# EAGLE design mem (EAGLE 9.6.2)
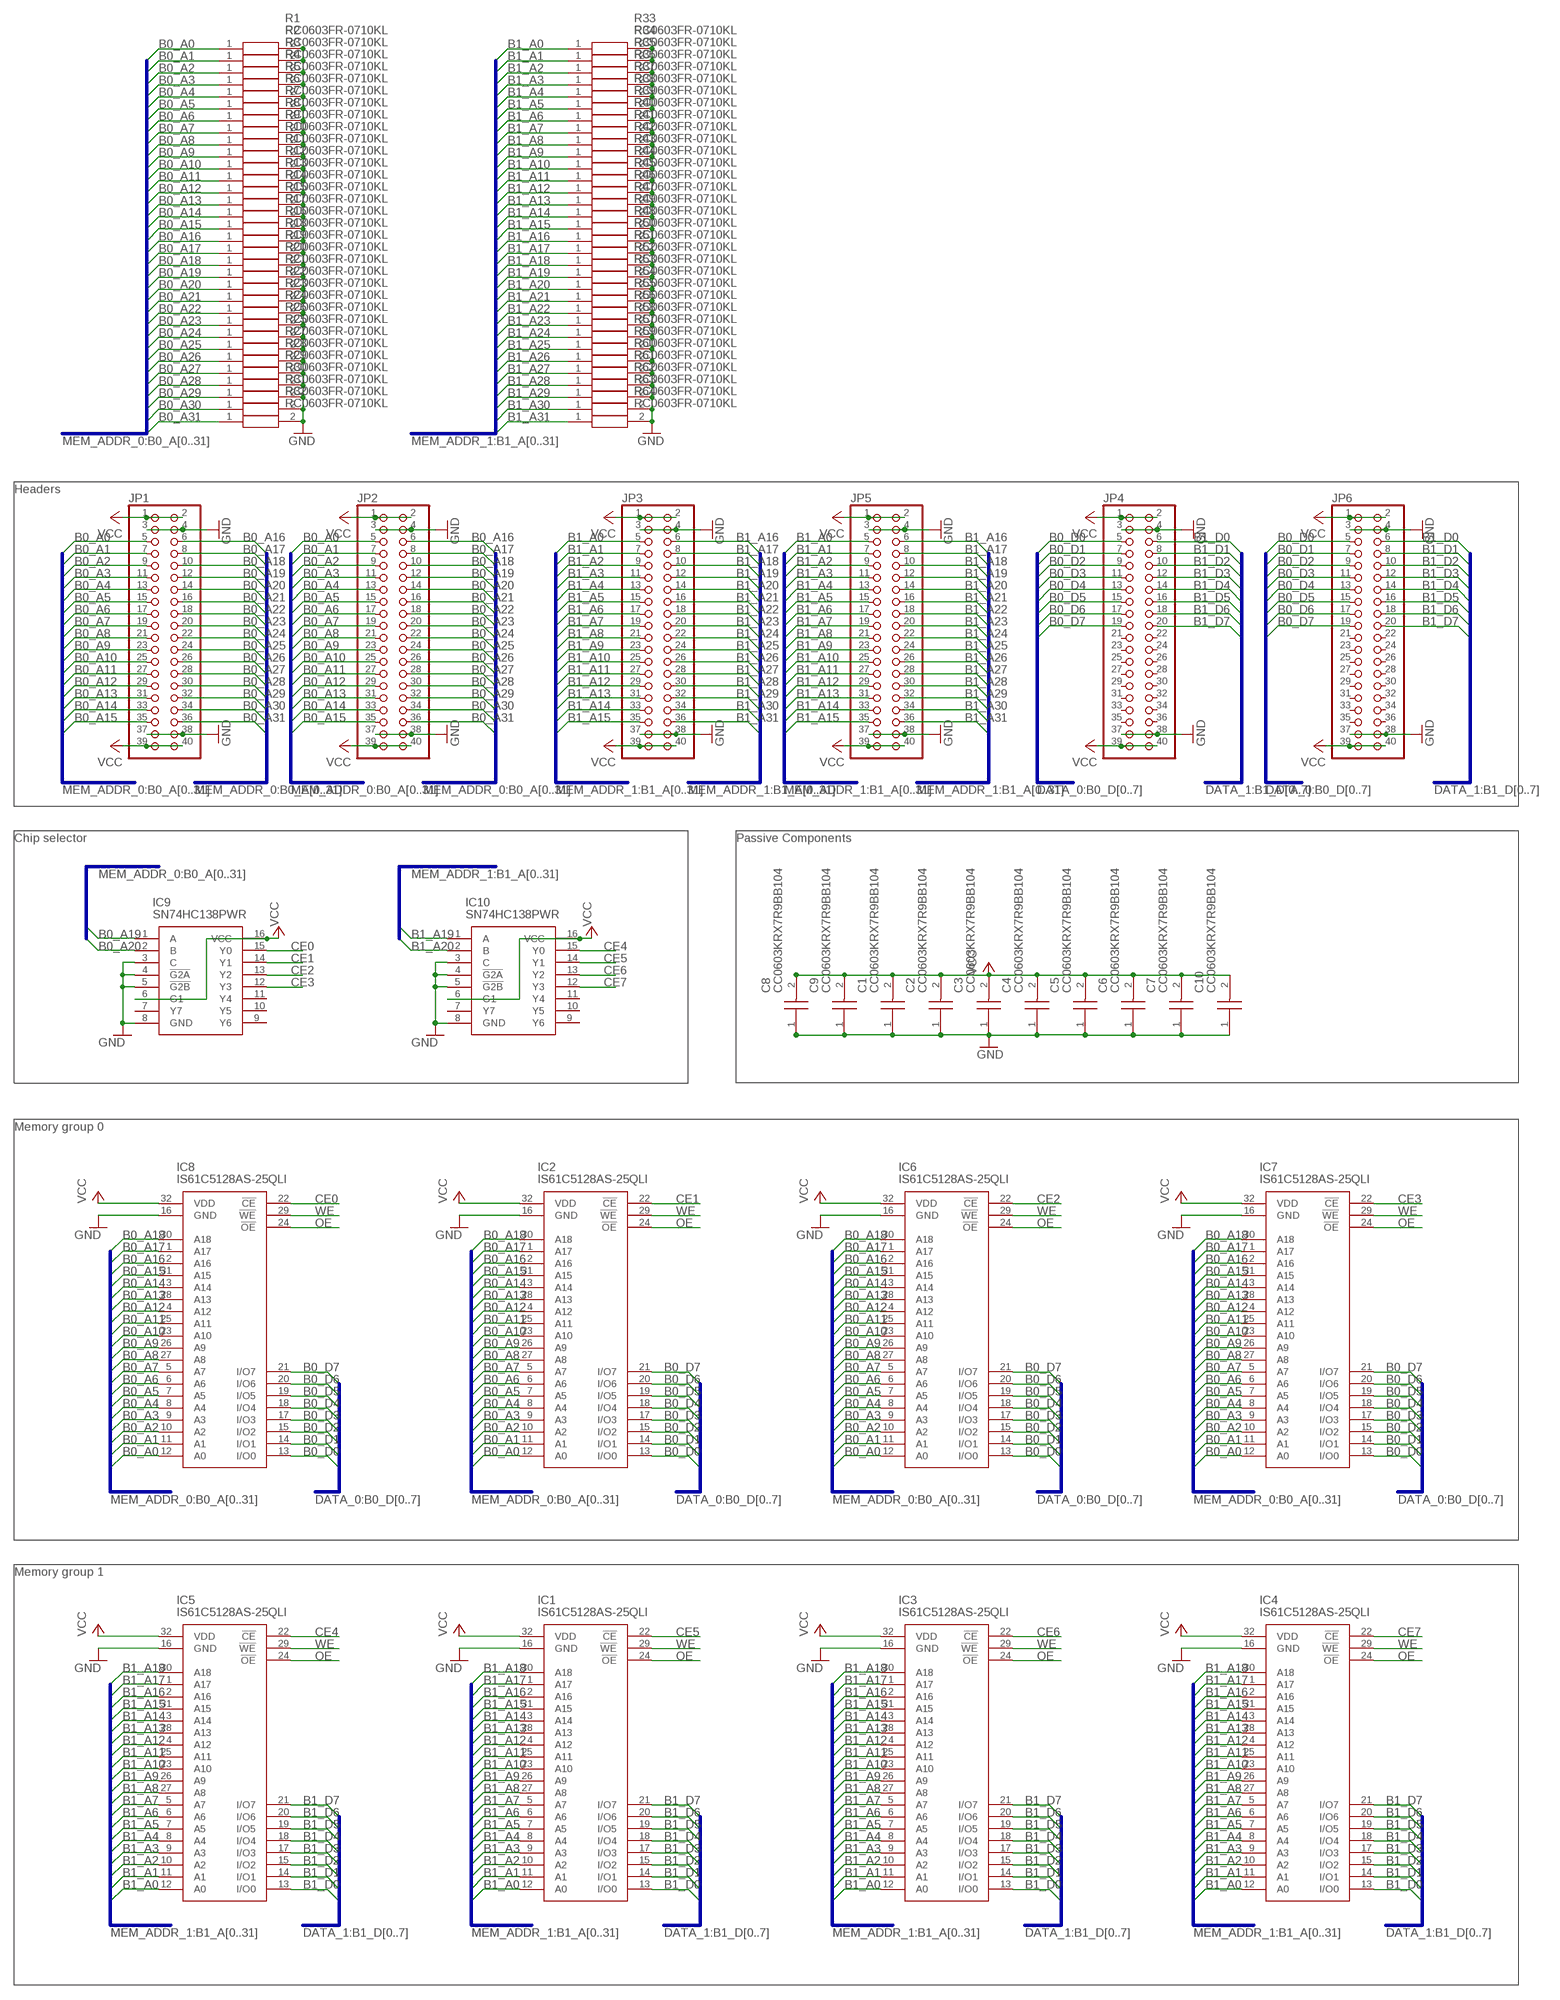
[diagram p0: schematic, sheet 1]

## Parts
C1  CC0603KRX7R9BB104  [CAPC1608X90N]
C2  CC0603KRX7R9BB104  [CAPC1608X90N]
C3  CC0603KRX7R9BB104  [CAPC1608X90N]
C4  CC0603KRX7R9BB104  [CAPC1608X90N]
C5  CC0603KRX7R9BB104  [CAPC1608X90N]
C6  CC0603KRX7R9BB104  [CAPC1608X90N]
C7  CC0603KRX7R9BB104  [CAPC1608X90N]
C8  CC0603KRX7R9BB104  [CAPC1608X90N]
C9  CC0603KRX7R9BB104  [CAPC1608X90N]
C10  CC0603KRX7R9BB104  [CAPC1608X90N]
IC1  IS61C5128AS-25QLI  [SOIC127P1412X305-32N]
IC2  IS61C5128AS-25QLI  [SOIC127P1412X305-32N]
IC3  IS61C5128AS-25QLI  [SOIC127P1412X305-32N]
IC4  IS61C5128AS-25QLI  [SOIC127P1412X305-32N]
IC5  IS61C5128AS-25QLI  [SOIC127P1412X305-32N]
IC6  IS61C5128AS-25QLI  [SOIC127P1412X305-32N]
IC7  IS61C5128AS-25QLI  [SOIC127P1412X305-32N]
IC8  IS61C5128AS-25QLI  [SOIC127P1412X305-32N]
IC9  SN74HC138PWR  [SOP65P640X120-16N]
IC10  SN74HC138PWR  [SOP65P640X120-16N]
JP1  PINHD-2X20  [2X20]
JP2  PINHD-2X20  [2X20]
JP3  PINHD-2X20  [2X20]
JP4  PINHD-2X20  [2X20]
JP5  PINHD-2X20  [2X20]
JP6  PINHD-2X20  [2X20]
R1  RC0603FR-0710KL  [RESC1608X55N]
R2  RC0603FR-0710KL  [RESC1608X55N]
R3  RC0603FR-0710KL  [RESC1608X55N]
R4  RC0603FR-0710KL  [RESC1608X55N]
R5  RC0603FR-0710KL  [RESC1608X55N]
R6  RC0603FR-0710KL  [RESC1608X55N]
R7  RC0603FR-0710KL  [RESC1608X55N]
R8  RC0603FR-0710KL  [RESC1608X55N]
R9  RC0603FR-0710KL  [RESC1608X55N]
R10  RC0603FR-0710KL  [RESC1608X55N]
R11  RC0603FR-0710KL  [RESC1608X55N]
R12  RC0603FR-0710KL  [RESC1608X55N]
R13  RC0603FR-0710KL  [RESC1608X55N]
R14  RC0603FR-0710KL  [RESC1608X55N]
R15  RC0603FR-0710KL  [RESC1608X55N]
R16  RC0603FR-0710KL  [RESC1608X55N]
R17  RC0603FR-0710KL  [RESC1608X55N]
R18  RC0603FR-0710KL  [RESC1608X55N]
R19  RC0603FR-0710KL  [RESC1608X55N]
R20  RC0603FR-0710KL  [RESC1608X55N]
R21  RC0603FR-0710KL  [RESC1608X55N]
R22  RC0603FR-0710KL  [RESC1608X55N]
R23  RC0603FR-0710KL  [RESC1608X55N]
R24  RC0603FR-0710KL  [RESC1608X55N]
R25  RC0603FR-0710KL  [RESC1608X55N]
R26  RC0603FR-0710KL  [RESC1608X55N]
R27  RC0603FR-0710KL  [RESC1608X55N]
R28  RC0603FR-0710KL  [RESC1608X55N]
R29  RC0603FR-0710KL  [RESC1608X55N]
R30  RC0603FR-0710KL  [RESC1608X55N]
R31  RC0603FR-0710KL  [RESC1608X55N]
R32  RC0603FR-0710KL  [RESC1608X55N]
R33  RC0603FR-0710KL  [RESC1608X55N]
R34  RC0603FR-0710KL  [RESC1608X55N]
R35  RC0603FR-0710KL  [RESC1608X55N]
R36  RC0603FR-0710KL  [RESC1608X55N]
R37  RC0603FR-0710KL  [RESC1608X55N]
R38  RC0603FR-0710KL  [RESC1608X55N]
R39  RC0603FR-0710KL  [RESC1608X55N]
R40  RC0603FR-0710KL  [RESC1608X55N]
R41  RC0603FR-0710KL  [RESC1608X55N]
R42  RC0603FR-0710KL  [RESC1608X55N]
R43  RC0603FR-0710KL  [RESC1608X55N]
R44  RC0603FR-0710KL  [RESC1608X55N]
R45  RC0603FR-0710KL  [RESC1608X55N]
R46  RC0603FR-0710KL  [RESC1608X55N]
R47  RC0603FR-0710KL  [RESC1608X55N]
R48  RC0603FR-0710KL  [RESC1608X55N]
R49  RC0603FR-0710KL  [RESC1608X55N]
R50  RC0603FR-0710KL  [RESC1608X55N]
R51  RC0603FR-0710KL  [RESC1608X55N]
R52  RC0603FR-0710KL  [RESC1608X55N]
R53  RC0603FR-0710KL  [RESC1608X55N]
R54  RC0603FR-0710KL  [RESC1608X55N]
R55  RC0603FR-0710KL  [RESC1608X55N]
R56  RC0603FR-0710KL  [RESC1608X55N]
R57  RC0603FR-0710KL  [RESC1608X55N]
R58  RC0603FR-0710KL  [RESC1608X55N]
R59  RC0603FR-0710KL  [RESC1608X55N]
R60  RC0603FR-0710KL  [RESC1608X55N]
R61  RC0603FR-0710KL  [RESC1608X55N]
R62  RC0603FR-0710KL  [RESC1608X55N]
R63  RC0603FR-0710KL  [RESC1608X55N]
R64  RC0603FR-0710KL  [RESC1608X55N]

## Nets
B0_A0: IC2.12(A0) IC6.12(A0) IC7.12(A0) IC8.12(A0) JP1.5 JP2.5 R1.1
B0_A1: IC2.11(A1) IC6.11(A1) IC7.11(A1) IC8.11(A1) JP1.7 JP2.7 R2.1
B0_A2: IC2.10(A2) IC6.10(A2) IC7.10(A2) IC8.10(A2) JP1.9 JP2.9 R3.1
B0_A3: IC2.9(A3) IC6.9(A3) IC7.9(A3) IC8.9(A3) JP1.11 JP2.11 R4.1
B0_A4: IC2.8(A4) IC6.8(A4) IC7.8(A4) IC8.8(A4) JP1.13 JP2.13 R5.1
B0_A5: IC2.7(A5) IC6.7(A5) IC7.7(A5) IC8.7(A5) JP1.15 JP2.15 R6.1
B0_A6: IC2.6(A6) IC6.6(A6) IC7.6(A6) IC8.6(A6) JP1.17 JP2.17 R7.1
B0_A7: IC2.5(A7) IC6.5(A7) IC7.5(A7) IC8.5(A7) JP1.19 JP2.19 R8.1
B0_A8: IC2.27(A8) IC6.27(A8) IC7.27(A8) IC8.27(A8) JP1.21 JP2.21 R9.1
B0_A9: IC2.26(A9) IC6.26(A9) IC7.26(A9) IC8.26(A9) JP1.23 JP2.23 R10.1
B0_A10: IC2.23(A10) IC6.23(A10) IC7.23(A10) IC8.23(A10) JP1.25 JP2.25 R11.1
B0_A11: IC2.25(A11) IC6.25(A11) IC7.25(A11) IC8.25(A11) JP1.27 JP2.27 R12.1
B0_A12: IC2.4(A12) IC6.4(A12) IC7.4(A12) IC8.4(A12) JP1.29 JP2.29 R13.1
B0_A13: IC2.28(A13) IC6.28(A13) IC7.28(A13) IC8.28(A13) JP1.31 JP2.31 R14.1
B0_A14: IC2.3(A14) IC6.3(A14) IC7.3(A14) IC8.3(A14) JP1.33 JP2.33 R15.1
B0_A15: IC2.31(A15) IC6.31(A15) IC7.31(A15) IC8.31(A15) JP1.35 JP2.35 R17.1
B0_A16: IC2.2(A16) IC6.2(A16) IC7.2(A16) IC8.2(A16) JP1.6 JP2.6 R16.1
B0_A17: IC2.1(A17) IC6.1(A17) IC7.1(A17) IC8.1(A17) JP1.8 JP2.8 R18.1
B0_A18: IC2.30(A18) IC6.30(A18) IC7.30(A18) IC8.30(A18) JP1.10 JP2.10 R19.1
B0_A19: IC9.1(A) JP1.12 JP2.12 R20.1
B0_A20: IC9.2(B) JP1.14 JP2.14 R21.1
B0_A21: JP1.16 JP2.16 R22.1
B0_A22: JP1.18 JP2.18 R23.1
B0_A23: JP1.20 JP2.20 R24.1
B0_A24: JP1.22 JP2.22 R26.1
B0_A25: JP1.24 JP2.24 R25.1
B0_A26: JP1.26 JP2.26 R27.1
B0_A27: JP1.28 JP2.28 R28.1
B0_A28: JP1.30 JP2.30 R29.1
B0_A29: JP1.32 JP2.32 R30.1
B0_A30: JP1.34 JP2.34 R31.1
B0_A31: JP1.36 JP2.36 R32.1
B0_D0: IC2.13(I/O0) IC6.13(I/O0) IC7.13(I/O0) IC8.13(I/O0) JP4.5 JP6.5
B0_D1: IC2.14(I/O1) IC6.14(I/O1) IC7.14(I/O1) IC8.14(I/O1) JP4.7 JP6.7
B0_D2: IC2.15(I/O2) IC6.15(I/O2) IC7.15(I/O2) IC8.15(I/O2) JP4.9 JP6.9
B0_D3: IC2.17(I/O3) IC6.17(I/O3) IC7.17(I/O3) IC8.17(I/O3) JP4.11 JP6.11
B0_D4: IC2.18(I/O4) IC6.18(I/O4) IC7.18(I/O4) IC8.18(I/O4) JP4.13 JP6.13
B0_D5: IC2.19(I/O5) IC6.19(I/O5) IC7.19(I/O5) IC8.19(I/O5) JP4.15 JP6.15
B0_D6: IC2.20(I/O6) IC6.20(I/O6) IC7.20(I/O6) IC8.20(I/O6) JP4.17 JP6.17
B0_D7: IC2.21(I/O7) IC6.21(I/O7) IC7.21(I/O7) IC8.21(I/O7) JP4.19 JP6.19
B1_A0: IC1.12(A0) IC3.12(A0) IC4.12(A0) IC5.12(A0) JP3.5 JP5.5 R33.1
B1_A1: IC1.11(A1) IC3.11(A1) IC4.11(A1) IC5.11(A1) JP3.7 JP5.7 R34.1
B1_A2: IC1.10(A2) IC3.10(A2) IC4.10(A2) IC5.10(A2) JP3.9 JP5.9 R35.1
B1_A3: IC1.9(A3) IC3.9(A3) IC4.9(A3) IC5.9(A3) JP3.11 JP5.11 R36.1
B1_A4: IC1.8(A4) IC3.8(A4) IC4.8(A4) IC5.8(A4) JP3.13 JP5.13 R37.1
B1_A5: IC1.7(A5) IC3.7(A5) IC4.7(A5) IC5.7(A5) JP3.15 JP5.15 R38.1
B1_A6: IC1.6(A6) IC3.6(A6) IC4.6(A6) IC5.6(A6) JP3.17 JP5.17 R39.1
B1_A7: IC1.5(A7) IC3.5(A7) IC4.5(A7) IC5.5(A7) JP3.19 JP5.19 R40.1
B1_A8: IC1.27(A8) IC3.27(A8) IC4.27(A8) IC5.27(A8) JP3.21 JP5.21 R41.1
B1_A9: IC1.26(A9) IC3.26(A9) IC4.26(A9) IC5.26(A9) JP3.23 JP5.23 R42.1
B1_A10: IC1.23(A10) IC3.23(A10) IC4.23(A10) IC5.23(A10) JP3.25 JP5.25 R43.1
B1_A11: IC1.25(A11) IC3.25(A11) IC4.25(A11) IC5.25(A11) JP3.27 JP5.27 R44.1
B1_A12: IC1.4(A12) IC3.4(A12) IC4.4(A12) IC5.4(A12) JP3.29 JP5.29 R45.1
B1_A13: IC1.28(A13) IC3.28(A13) IC4.28(A13) IC5.28(A13) JP3.31 JP5.31 R46.1
B1_A14: IC1.3(A14) IC3.3(A14) IC4.3(A14) IC5.3(A14) JP3.33 JP5.33 R47.1
B1_A15: IC1.31(A15) IC3.31(A15) IC4.31(A15) IC5.31(A15) JP3.35 JP5.35 R49.1
B1_A16: IC1.2(A16) IC3.2(A16) IC4.2(A16) IC5.2(A16) JP3.6 JP5.6 R48.1
B1_A17: IC1.1(A17) IC3.1(A17) IC4.1(A17) IC5.1(A17) JP3.8 JP5.8 R50.1
B1_A18: IC1.30(A18) IC3.30(A18) IC4.30(A18) IC5.30(A18) JP3.10 JP5.10 R51.1
B1_A19: IC10.1(A) JP3.12 JP5.12 R52.1
B1_A20: IC10.2(B) JP3.14 JP5.14 R53.1
B1_A21: JP3.16 JP5.16 R54.1
B1_A22: JP3.18 JP5.18 R55.1
B1_A23: JP3.20 JP5.20 R56.1
B1_A24: JP3.22 JP5.22 R58.1
B1_A25: JP3.24 JP5.24 R57.1
B1_A26: JP3.26 JP5.26 R59.1
B1_A27: JP3.28 JP5.28 R60.1
B1_A28: JP3.30 JP5.30 R61.1
B1_A29: JP3.32 JP5.32 R62.1
B1_A30: JP3.34 JP5.34 R63.1
B1_A31: JP3.36 JP5.36 R64.1
B1_D0: IC1.13(I/O0) IC3.13(I/O0) IC4.13(I/O0) IC5.13(I/O0) JP4.6 JP6.6
B1_D1: IC1.14(I/O1) IC3.14(I/O1) IC4.14(I/O1) IC5.14(I/O1) JP4.8 JP6.8
B1_D2: IC1.15(I/O2) IC3.15(I/O2) IC4.15(I/O2) IC5.15(I/O2) JP4.10 JP6.10
B1_D3: IC1.17(I/O3) IC3.17(I/O3) IC4.17(I/O3) IC5.17(I/O3) JP4.12 JP6.12
B1_D4: IC1.18(I/O4) IC3.18(I/O4) IC4.18(I/O4) IC5.18(I/O4) JP4.14 JP6.14
B1_D5: IC1.19(I/O5) IC3.19(I/O5) IC4.19(I/O5) IC5.19(I/O5) JP4.16 JP6.16
B1_D6: IC1.20(I/O6) IC3.20(I/O6) IC4.20(I/O6) IC5.20(I/O6) JP4.18 JP6.18
B1_D7: IC1.21(I/O7) IC3.21(I/O7) IC4.21(I/O7) IC5.21(I/O7) JP4.20 JP6.20
CE0: IC8.22(!CE) IC9.15(Y0)
CE1: IC2.22(!CE) IC9.14(Y1)
CE2: IC6.22(!CE) IC9.13(Y2)
CE3: IC7.22(!CE) IC9.12(Y3)
CE4: IC5.22(!CE) IC10.15(Y0)
CE5: IC1.22(!CE) IC10.14(Y1)
CE6: IC3.22(!CE) IC10.13(Y2)
CE7: IC4.22(!CE) IC10.12(Y3)
GND [power]: C1.1 C2.1 C3.1 C4.1 C5.1 C6.1 C7.1 C8.1 C9.1 C10.1 IC1.16(GND) IC2.16(GND) IC3.16(GND) IC4.16(GND) IC5.16(GND) IC6.16(GND) IC7.16(GND) IC8.16(GND) IC9.3(C) IC9.4(!G2A) IC9.5(!G2B) IC9.8(GND) IC10.3(C) IC10.4(!G2A) IC10.5(!G2B) IC10.8(GND) JP1.3 JP1.4 JP1.37 JP1.38 JP2.3 JP2.4 JP2.37 JP2.38 JP3.3 JP3.4 JP3.37 JP3.38 JP4.3 JP4.4 JP4.37 JP4.38 JP5.3 JP5.4 JP5.37 JP5.38 JP6.3 JP6.4 JP6.37 JP6.38 R1.2 R2.2 R3.2 R4.2 R5.2 R6.2 R7.2 R8.2 R9.2 R10.2 R11.2 R12.2 R13.2 R14.2 R15.2 R16.2 R17.2 R18.2 R19.2 R20.2 R21.2 R22.2 R23.2 R24.2 R25.2 R26.2 R27.2 R28.2 R29.2 R30.2 R31.2 R32.2 R33.2 R34.2 R35.2 R36.2 R37.2 R38.2 R39.2 R40.2 R41.2 R42.2 R43.2 R44.2 R45.2 R46.2 R47.2 R48.2 R49.2 R50.2 R51.2 R52.2 R53.2 R54.2 R55.2 R56.2 R57.2 R58.2 R59.2 R60.2 R61.2 R62.2 R63.2 R64.2
OE: IC1.24(!OE) IC2.24(!OE) IC3.24(!OE) IC4.24(!OE) IC5.24(!OE) IC6.24(!OE) IC7.24(!OE) IC8.24(!OE)
VCC [power]: C1.2 C2.2 C3.2 C4.2 C5.2 C6.2 C7.2 C8.2 C9.2 C10.2 IC1.32(VDD) IC2.32(VDD) IC3.32(VDD) IC4.32(VDD) IC5.32(VDD) IC6.32(VDD) IC7.32(VDD) IC8.32(VDD) IC9.6(G1) IC9.16(VCC) IC10.6(G1) IC10.16(VCC) JP1.1 JP1.2 JP1.39 JP1.40 JP2.1 JP2.2 JP2.39 JP2.40 JP3.1 JP3.2 JP3.39 JP3.40 JP4.1 JP4.2 JP4.39 JP4.40 JP5.1 JP5.2 JP5.39 JP5.40 JP6.1 JP6.2 JP6.39 JP6.40
WE: IC1.29(!WE) IC2.29(!WE) IC3.29(!WE) IC4.29(!WE) IC5.29(!WE) IC6.29(!WE) IC7.29(!WE) IC8.29(!WE)
Unconnected: IC9.7(Y7) IC9.9(Y6) IC9.10(Y5) IC9.11(Y4) IC10.7(Y7) IC10.9(Y6) IC10.10(Y5) IC10.11(Y4) JP4.21 JP4.22 JP4.23 JP4.24 JP4.25 JP4.26 JP4.27 JP4.28 JP4.29 JP4.30 JP4.31 JP4.32 JP4.33 JP4.34 JP4.35 JP4.36 JP6.21 JP6.22 JP6.23 JP6.24 JP6.25 JP6.26 JP6.27 JP6.28 JP6.29 JP6.30 JP6.31 JP6.32 JP6.33 JP6.34 JP6.35 JP6.36

## Buses
MEM_ADDR_0:B0_A[0..31]
MEM_ADDR_1:B1_A[0..31]
DATA_0:B0_D[0..7]
DATA_1:B1_D[0..7]
B$1

## Notes on the sheet
- Headers
- Chip selector | Passive Components
- Memory group 0
- Memory group 1

## Library data of the parts
C1-C10 = CC0603KRX7R9BB104:CC0603KRX7R9BB104: CAPACITOR, 0603 100nF +/-10% 50V Source: Datasheet <http://componentsearchengine.com/Datasheets/3/CC0603KRX7R9BB104.pdf>; ARROW_PART_NUMBER: CC0603KRX7R9BB104; ARROW_PRICE-STOCK: https://www.arrow.com/en/products/cc0603krx7r9bb104/yageo?region=nac; DESCRIPTION: CAPACITOR, 0603 100nF +/-10% 50V; HEIGHT: 0.9mm; MANUFACTURER_NAME: YAGEO (PHYCOMP); MANUFACTURER_PART_NUMBER: CC0603KRX7R9BB104; MOUSER_PART_NUMBER: 603-CC603KRX7R9BB104; MOUSER_PRICE-STOCK: https://www.mouser.co.uk/ProductDetail/YAGEO/CC0603KRX7R9BB104?qs=vTakOoo5QyLvVCYM2ge8LQ%3D%3D
IC1-IC8 = IS61C5128AS-25QLI:IS61C5128AS-25QLI: SRAM 4Mb,High-Speed,Low Power,Async,512K x 8,25ns,5v,32 Pin SOP (450 mil), RoHS Source: Datasheet <http://www.issi.com/WW/pdf/61-64C5128AL.pdf>; ARROW_PART_NUMBER: IS61C5128AS-25QLI; ARROW_PRICE-STOCK: https://www.arrow.com/en/products/is61c5128as-25qli/integrated-silicon-solution-inc; DESCRIPTION: SRAM 4Mb,High-Speed,Low Power,Async,512K x 8,25ns,5v,32 Pin SOP (450 mil), RoHS; HEIGHT: 3.05mm; MANUFACTURER_NAME: Integrated Silicon Solution Inc.; MANUFACTURER_PART_NUMBER: IS61C5128AS-25QLI; MOUSER_PART_NUMBER: 870-61C5128AS-25QLI; MOUSER_PRICE-STOCK: https://www.mouser.co.uk/ProductDetail/ISSI/IS61C5128AS-25QLI/?qs=v9o34zvNDAYPCnMwiEH0%252BA%3D%3D
IC9 IC10 = SN74HC138PWR:SN74HC138PWR: 3-Line To 8-Line Decoders/Demultiplexers Source: Datasheet <http://www.ti.com/lit/gpn/sn74hc138>; ARROW_PART_NUMBER: SN74HC138PWR; ARROW_PRICE-STOCK: https://www.arrow.com/en/products/sn74hc138pwr/texas-instruments; DESCRIPTION: 3-Line To 8-Line Decoders/Demultiplexers; HEIGHT: 1.2mm; MANUFACTURER_NAME: Texas Instruments; MANUFACTURER_PART_NUMBER: SN74HC138PWR; MOUSER_PART_NUMBER: 595-SN74HC138PWR; MOUSER_PRICE-STOCK: https://www.mouser.co.uk/ProductDetail/Texas-Instruments/SN74HC138PWR?qs=WzgTT80quPG%2F%252Bg2Du7xoUA%3D%3D
JP1-JP6 = pinhead:PINHD-2X20: PIN HEADER
R1-R64 = RC0603FR-0710KL:RC0603FR-0710KL: Yageo RC Series Thick Film Surface Mount Resistor 0603 Case 10k Source: Datasheet <https://datasheet.datasheetarchive.com/originals/distributors/Datasheets_SAMA/902f9e387b938f871d31120f5fc1d65e.pdf>; ARROW_PART_NUMBER: RC0603FR-0710KL; ARROW_PRICE-STOCK: https://www.arrow.com/en/products/rc0603fr-0710kl/yageo?region=nac; DESCRIPTION: Yageo RC Series Thick Film Surface Mount Resistor 0603 Case 10k; HEIGHT: 0.55mm; MANUFACTURER_NAME: YAGEO (PHYCOMP); MANUFACTURER_PART_NUMBER: RC0603FR-0710KL; MOUSER_PART_NUMBER: 603-RC0603FR-0710KL; MOUSER_PRICE-STOCK: https://www.mouser.co.uk/ProductDetail/YAGEO/RC0603FR-0710KL?qs=grNVn54RoB%252B3GtjbJj3wJQ%3D%3D

## Board
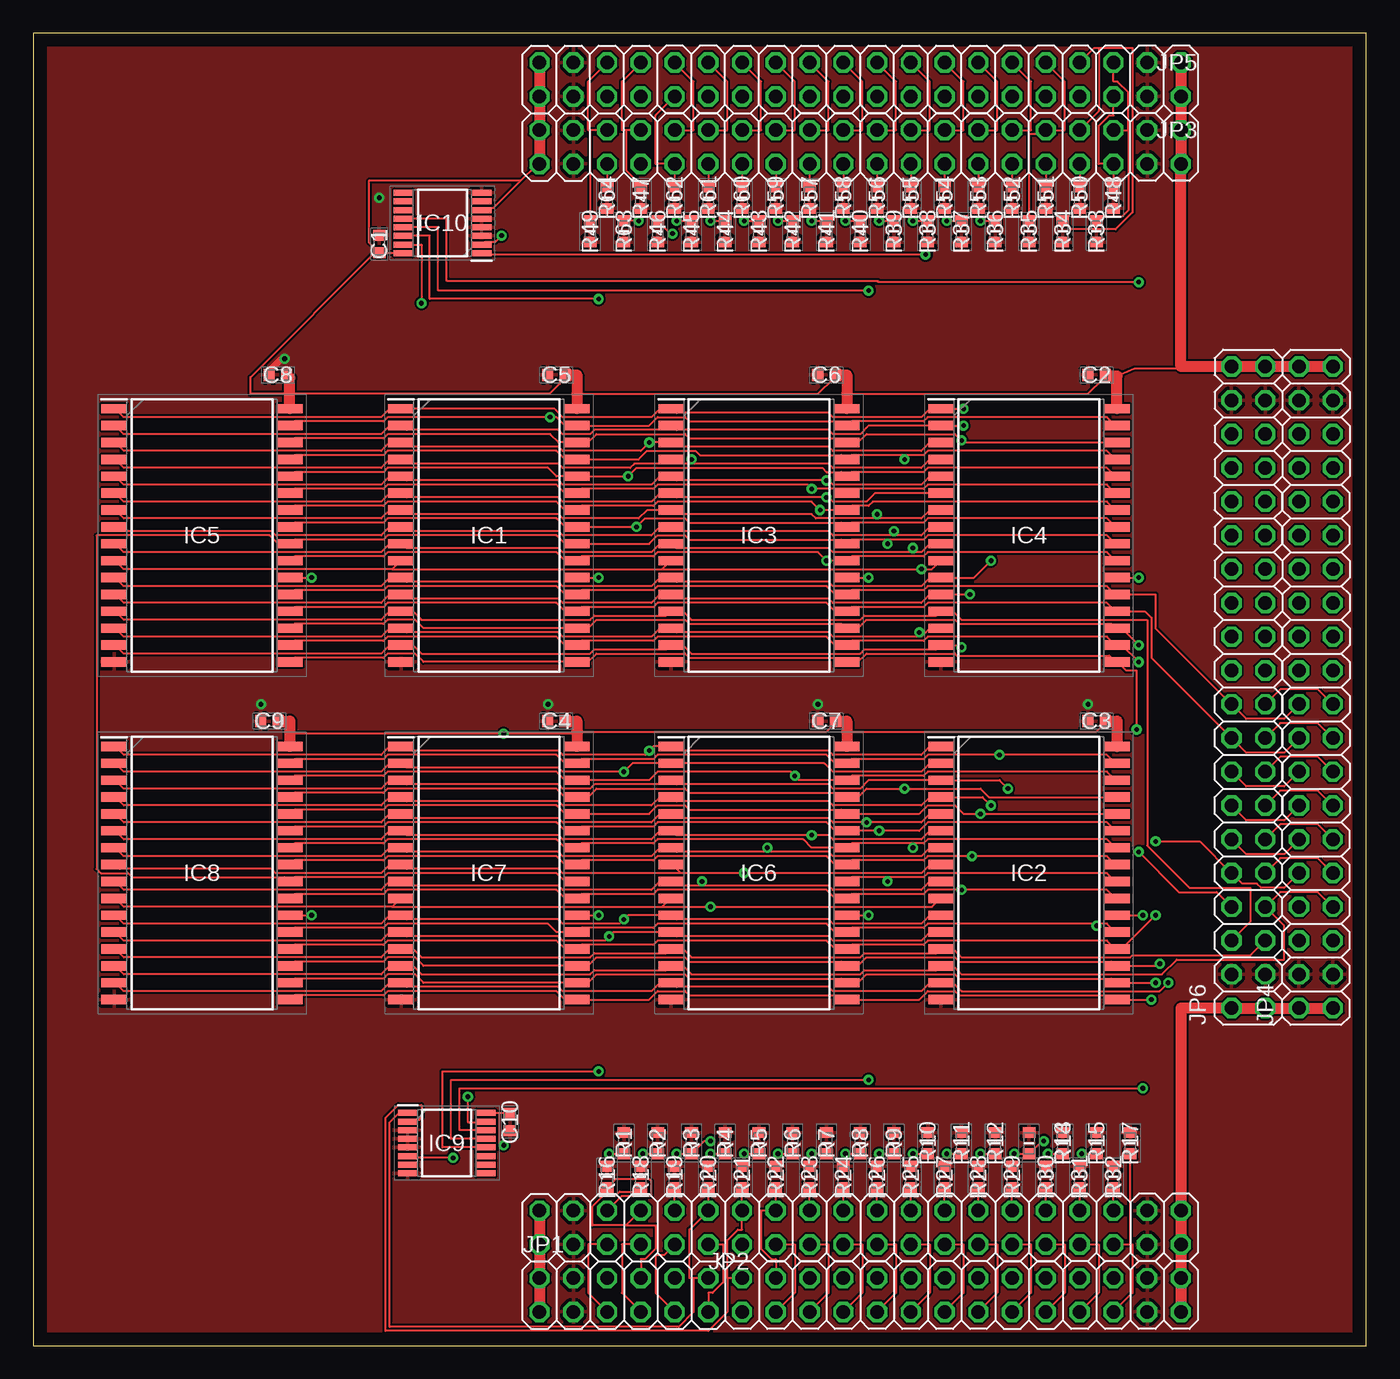
[diagram p1: board, top side]
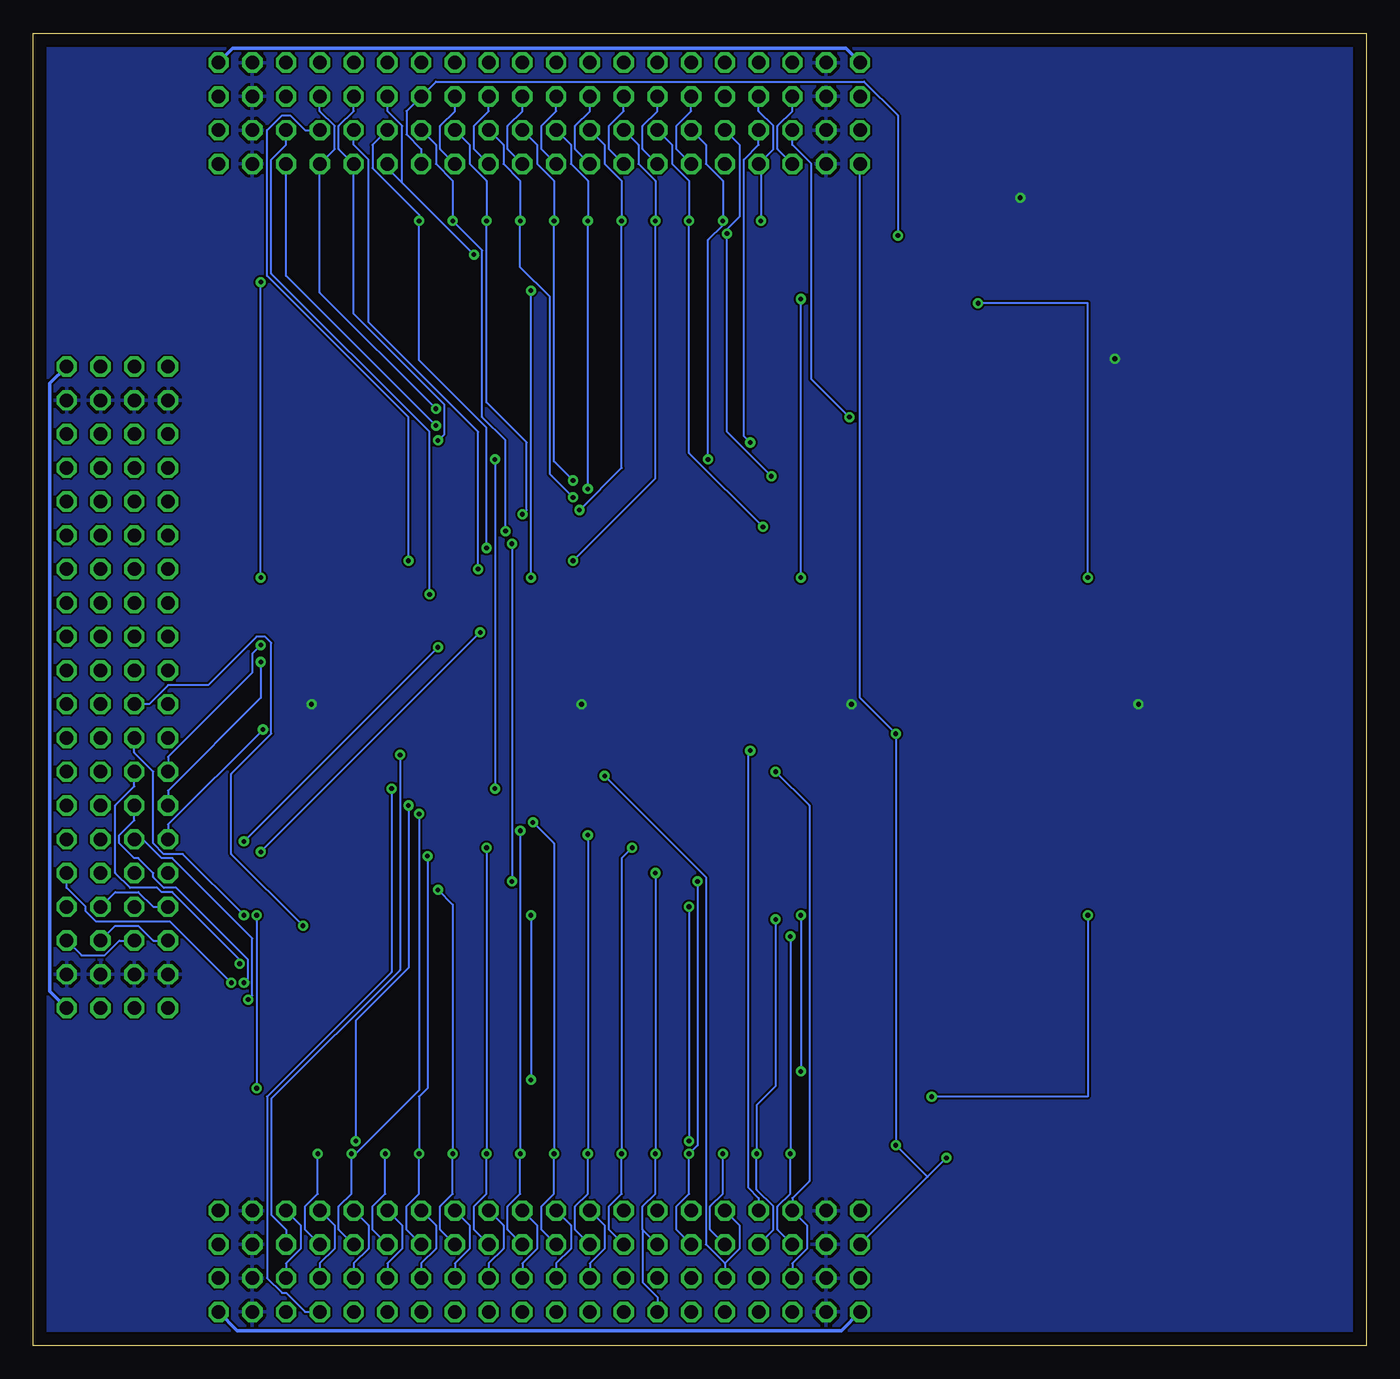
[diagram p2: board, bottom side, seen from below]

Size 100.31 x 98.73 mm. Coordinates in mm from the lower left corner, seen from the top.
Outline: 0,0 100.31,0 100.31,98.73 0,98.73 0,0
Copper layers (1*16): Top 0.035mm / dielectric 1.5mm / Bottom 0.035mm
Design rules "default *": minimum track width 6mil, minimum drill 0.35mm, track to track 6mil, track to pad 6mil, pad to pad 6mil, via to via 6mil, smd to smd 6mil, copper to edge 40mil, drill to drill 6mil, minimum pad ring 10mil, minimum via ring 8mil, stop-mask expansion 4mil, vias tented up to drill 0mil, thermal gap 10mil

### Footprints (pad centres in the part's own frame; a part is rotated, then mirrored left to right if it is on the bottom)
CAPC1608X90N = smd 0.83 x 0.94: 1 -0.66,0; 2 0.66,0
SOIC127P1412X305-32N = smd 1.922 x 0.7: 1 -6.614,9.525; 2 -6.614,8.255; 3 -6.614,6.985; 4 -6.614,5.715; 5 -6.614,4.445; 6 -6.614,3.175; 7 -6.614,1.905; 8 -6.614,0.635; 9 -6.614,-0.635; 10 -6.614,-1.905; 11 -6.614,-3.175; 12 -6.614,-4.445; 13 -6.614,-5.715; 14 -6.614,-6.985; 15 -6.614,-8.255; 16 -6.614,-9.525; 17 6.614,-9.525; 18 6.614,-8.255; 19 6.614,-6.985; 20 6.614,-5.715; 21 6.614,-4.445; 22 6.614,-3.175; 23 6.614,-1.905; 24 6.614,-0.635; 25 6.614,0.635; 26 6.614,1.905; 27 6.614,3.175; 28 6.614,4.445; 29 6.614,5.715; 30 6.614,6.985; 31 6.614,8.255; 32 6.614,9.525
SOP65P640X120-16N = smd 1.475 x 0.45: 1 -2.938,2.275; 2 -2.938,1.625; 3 -2.938,0.975; 4 -2.938,0.325; 5 -2.938,-0.325; 6 -2.938,-0.975; 7 -2.938,-1.625; 8 -2.938,-2.275; 9 2.938,-2.275; 10 2.938,-1.625; 11 2.938,-0.975; 12 2.938,-0.325; 13 2.938,0.325; 14 2.938,0.975; 15 2.938,1.625; 16 2.938,2.275
2X20 = drill 1.016 octagon: 1 -24.13,-1.27; 2 -24.13,1.27; 3 -21.59,-1.27; 4 -21.59,1.27; 5 -19.05,-1.27; 6 -19.05,1.27; 7 -16.51,-1.27; 8 -16.51,1.27; 9 -13.97,-1.27; 10 -13.97,1.27; 11 -11.43,-1.27; 12 -11.43,1.27; 13 -8.89,-1.27; 14 -8.89,1.27; 15 -6.35,-1.27; 16 -6.35,1.27; 17 -3.81,-1.27; 18 -3.81,1.27; 19 -1.27,-1.27; 20 -1.27,1.27; 21 1.27,-1.27; 22 1.27,1.27; 23 3.81,-1.27; 24 3.81,1.27; 25 6.35,-1.27; 26 6.35,1.27; 27 8.89,-1.27; 28 8.89,1.27; 29 11.43,-1.27; 30 11.43,1.27; 31 13.97,-1.27; 32 13.97,1.27; 33 16.51,-1.27; 34 16.51,1.27; 35 19.05,-1.27; 36 19.05,1.27; 37 21.59,-1.27; 38 21.59,1.27; 39 24.13,-1.27; 40 24.13,1.27
RESC1608X55N = smd 0.8 x 0.95: 1 -0.8,0; 2 0.8,0

### Placement (x,y rotation side)
C1  26.04,82.87 270 top
C2  80.01,73.03 0 top
C3  80.01,46.99 0 top
C4  39.37,46.99 0 top
C5  39.37,73.03 0 top
C6  59.69,73.03 0 top
C7  59.69,46.99 0 top
C8  18.41,73.03 0 top
C9  17.78,46.99 0 top
C10  35.88,16.83 90 top
IC1  34.29,60.96 0 top
IC2  74.93,35.56 0 top
IC3  54.61,60.96 0 top
IC4  74.93,60.96 0 top
IC5  12.7,60.96 0 top
IC6  54.61,35.56 0 top
IC7  34.29,35.56 0 top
IC8  12.7,35.56 0 top
IC9  31.11,15.24 0 top
IC10  30.8,84.45 180 top
JP1  62.23,3.81 0 top
JP2  62.23,8.89 0 top
JP3  62.23,95.25 180 top
JP4  96.52,49.53 90 top
JP5  62.23,90.17 180 top
JP6  91.44,49.53 90 top
R1  44.45,15.24 90 top
R2  46.99,15.24 90 top
R3  49.53,15.24 90 top
R4  52.07,15.24 90 top
R5  54.61,15.24 90 top
R6  57.15,15.24 90 top
R7  59.69,15.24 90 top
R8  62.23,15.24 90 top
R9  64.77,15.24 90 top
R10  67.31,15.24 90 top
R11  69.85,15.24 90 top
R12  72.39,15.24 90 top
R13  74.93,15.24 90 top
R14  77.47,15.24 90 top
R15  80.01,15.24 90 top
R16  43.18,12.7 90 top
R17  82.55,15.24 90 top
R18  45.72,12.7 90 top
R19  48.26,12.7 90 top
R20  50.8,12.7 90 top
R21  53.34,12.7 90 top
R22  55.88,12.7 90 top
R23  58.42,12.7 90 top
R24  60.96,12.7 90 top
R25  66.04,12.7 90 top
R26  63.5,12.7 90 top
R27  68.58,12.7 90 top
R28  71.12,12.7 90 top
R29  73.66,12.7 90 top
R30  76.2,12.7 90 top
R31  78.74,12.7 90 top
R32  81.28,12.7 90 top
R33  80.01,83.82 270 top
R34  77.47,83.82 270 top
R35  74.93,83.82 270 top
R36  72.39,83.82 270 top
R37  69.85,83.82 270 top
R38  67.31,83.82 270 top
R39  64.77,83.82 270 top
R40  62.23,83.82 270 top
R41  59.69,83.82 270 top
R42  57.15,83.82 270 top
R43  54.61,83.82 270 top
R44  52.07,83.82 270 top
R45  49.53,83.82 270 top
R46  46.99,83.82 270 top
R47  45.72,86.36 270 top
R48  81.28,86.36 270 top
R49  41.91,83.82 270 top
R50  78.74,86.36 270 top
R51  76.2,86.36 270 top
R52  73.66,86.36 270 top
R53  71.12,86.36 270 top
R54  68.58,86.36 270 top
R55  66.04,86.36 270 top
R56  63.5,86.36 270 top
R57  58.42,86.36 270 top
R58  60.96,86.36 270 top
R59  55.88,86.36 270 top
R60  53.34,86.36 270 top
R61  50.8,86.36 270 top
R62  48.26,86.36 270 top
R63  44.45,83.82 270 top
R64  43.18,86.36 270 top

### Tracks (layer width: path | path; a pad name or v marks a point on that pad's centre or on a via)
B0_A0  (via drill 0.35)
  Top 0.152: IC8.12 6.19,31.11 6.83,30.48 26.19,30.48 26.83,31.11 IC7.12 27.78,31.11 28.1,30.8 39.53,30.8 39.85,30.48 43.02,30.48 v43.34,30.8 43.66,31.11 IC6.12 48.1,31.11 48.42,30.8 59.85,30.8 60.17,30.48 66.83,30.48 67.47,31.11 IC2.12 | v43.34,14.45 R1.1 | JP1.5 41.75,3.97 41.75,7.62 JP2.5
  Bottom 0.152: JP2.5 44.29,8.73 44.29,10.48 43.34,11.43 v43.34,14.45 v43.34,30.8
B0_A1  (via drill 0.35)
  Top 0.152: IC8.11 6.19,32.38 6.83,31.75 26.19,31.75 26.83,32.38 IC7.11 27.78,32.38 28.1,32.07 39.53,32.07 39.85,31.75 44.13,31.75 v44.45,32.07 44.77,32.38 IC6.11 48.1,32.38 48.42,32.07 59.85,32.07 60.17,31.75 66.83,31.75 67.47,32.38 IC2.11 | v45.88,14.45 R2.1 | JP1.7 44.29,3.97 44.29,7.62 JP2.7
  Bottom 0.152: JP2.7 44.61,8.73 44.61,10.48 45.88,11.75 v45.88,14.45 45.88,18.1 44.45,19.53 v44.45,32.07
B0_A2  (via drill 0.35)
  Top 0.152: v48.42,14.45 R3.1 | JP1.9 46.83,3.97 46.83,6.83 47.47,6.83 JP2.9 | 26.99,33.02 6.83,33.02 6.19,33.66 IC8.10 | 26.99,33.02 27.62,33.66 IC7.10 | 47.31,33.02 47.94,33.66 IC6.10 | 26.99,33.02 47.31,33.02 | 47.31,33.02 v50.96,33.02 67.63,33.02 68.26,33.66 IC2.10 | R3.1 50.48,15.4 v50.96,15.4 | R3.1
  Bottom 0.152: v48.42,14.45 48.42,11.43 49.37,10.48 49.37,8.73 JP2.9 | v50.96,33.02 v50.96,15.4
B0_A3  (via drill 0.35)
  Top 0.152: IC8.9 6.19,34.92 6.83,34.29 26.19,34.29 26.83,34.92 IC7.9 27.78,34.92 28.1,34.61 39.53,34.61 39.85,34.29 46.51,34.29 47.15,34.92 IC6.9 48.1,34.92 48.42,34.61 50.32,34.61 | v50.96,14.45 R4.1 | JP1.11 50.8,3.97 51.12,3.97 51.91,4.76 51.91,7.62 JP2.11 | 50.32,34.61 59.85,34.61 60.17,34.29 66.83,34.29 67.47,34.92 IC2.9 | 50.32,34.61 v50.32,34.92
  Bottom 0.152: JP2.11 51.91,8.73 51.91,10.48 50.96,11.43 v50.96,14.45 50.32,15.08 v50.32,34.92
B0_A4  (via drill 0.35)
  Top 0.152: IC8.8 6.19,36.2 6.51,35.88 17.94,35.88 18.26,35.56 26.19,35.56 26.83,36.2 IC7.8 27.78,36.2 28.1,35.88 39.53,35.88 39.85,35.56 48.74,35.56 | v53.5,14.45 R5.1 | 48.74,35.56 48.1,36.2 IC6.8 | 48.74,35.56 v53.5,35.56 66.83,35.56 67.47,36.2 IC2.8
  Bottom 0.152: 54.45,8.73 54.45,10.48 53.5,11.43 v53.5,14.45 v53.5,35.56 | JP2.13 54.45,8.73 | JP1.13 53.34,3.65 54.45,4.76 54.45,8.73
B0_A5  (via drill 0.35)
  Top 0.152: IC8.7 6.19,37.47 6.83,36.83 26.19,36.83 26.83,37.47 IC7.7 27.78,37.47 28.1,37.15 39.53,37.15 39.85,36.83 46.51,36.83 47.15,37.47 IC6.7 48.1,37.47 48.42,37.15 55.24,37.15 | v56.04,14.45 R6.1 | JP1.15 57.31,3.97 57.31,7.62 JP2.15 | 55.24,37.15 59.85,37.15 60.17,36.83 66.83,36.83 67.47,37.47 IC2.7 | 55.24,37.15 v55.24,37.47
  Bottom 0.152: JP2.15 56.99,8.73 56.99,10.48 56.04,11.43 v56.04,14.45 56.04,36.67 v55.24,37.47
B0_A6  (via drill 0.35)
  Top 0.152: IC8.6 6.19,38.73 6.83,38.1 26.19,38.1 26.83,38.73 IC7.6 27.78,38.73 28.1,38.42 39.53,38.42 39.85,38.1 46.51,38.1 47.15,38.73 IC6.6 48.1,38.73 48.42,38.42 v58.58,38.42 59.85,38.42 60.17,38.1 66.83,38.1 67.47,38.73 IC2.6 | v58.58,14.45 R7.1 | JP1.17 59.85,3.97 59.85,7.62 JP2.17
  Bottom 0.152: JP2.17 59.53,8.73 59.53,10.48 58.58,11.43 v58.58,14.45 v58.58,38.42
B0_A7  (via drill 0.35)
  Top 0.152: IC8.5 6.19,40.01 6.83,39.37 26.19,39.37 26.83,40.01 IC7.5 27.78,40.01 28.1,39.69 39.53,39.69 39.85,39.37 46.51,39.37 47.15,40.01 IC6.5 48.1,40.01 48.42,39.69 59.85,39.69 60.17,39.37 v62.71,39.37 66.83,39.37 67.47,40.01 IC2.5 | v61.12,14.45 R8.1 | JP1.19 62.39,3.97 62.39,7.62 JP2.19
  Bottom 0.152: JP2.19 62.07,8.73 62.07,10.48 61.12,11.43 v61.12,14.45 61.12,37.78 v62.71,39.37
B0_A8  (via drill 0.35)
  Top 0.152: IC8.27 19.37,38.73 19.68,39.05 26.35,39.05 26.67,39.37 39.37,39.37 40.01,38.73 IC7.27 40.96,38.73 41.27,39.05 46.67,39.05 46.99,39.37 59.69,39.37 60.33,38.73 IC6.27 v63.66,38.73 66.67,38.73 67.31,39.37 80.8,39.37 81.44,38.73 IC2.27 | v63.66,14.45 R9.1 | JP1.21 64.93,3.97 64.93,7.62 JP2.21
  Bottom 0.152: JP2.21 64.61,8.73 64.61,10.48 63.66,11.43 v63.66,14.45 v63.66,38.73
B0_A9  (via drill 0.35)
  Top 0.152: IC8.26 19.37,37.47 19.68,37.78 26.35,37.78 26.67,38.1 39.37,38.1 40.01,37.47 IC7.26 40.96,37.47 41.27,37.78 46.67,37.78 46.99,38.1 57.94,38.1 58.58,37.47 IC6.26 61.28,37.47 61.59,37.78 66.2,37.78 | v66.2,14.45 R10.1 | JP1.23 67.47,3.97 67.47,7.62 JP2.23 | 66.2,37.78 66.99,37.78 67.31,38.1 80.8,38.1 81.44,37.47 IC2.26 | 66.2,37.78 v66.2,37.47
  Bottom 0.152: JP2.23 67.15,8.73 67.15,10.48 66.2,11.43 v66.2,14.45 v66.2,37.47
B0_A10  (via drill 0.35)
  Top 0.152: IC8.23 19.37,33.66 19.68,33.97 26.35,33.97 26.67,34.29 39.37,34.29 40.01,33.66 IC7.23 40.96,33.66 41.27,33.97 46.67,33.97 46.99,34.29 59.69,34.29 60.33,33.66 IC6.23 61.28,33.66 61.59,33.97 66.99,33.97 67.31,34.29 v69.85,34.29 80.8,34.29 81.44,33.66 IC2.23 | v68.74,14.45 R11.1 | JP1.25 70.01,3.97 70.01,7.62 JP2.25
  Bottom 0.152: JP2.25 69.69,8.73 69.69,10.48 68.74,11.43 v68.74,14.45 68.74,33.18 v69.85,34.29
B0_A11  (via drill 0.35)
  Top 0.152: IC8.25 19.37,36.2 19.68,36.51 26.35,36.51 26.67,36.83 39.37,36.83 40.01,36.2 IC7.25 40.96,36.2 41.27,36.51 46.67,36.51 46.99,36.83 59.69,36.83 60.33,36.2 IC6.25 61.28,36.2 61.59,36.51 66.99,36.51 67.31,36.83 v70.64,36.83 80.8,36.83 81.44,36.2 IC2.25 | v71.28,14.45 R12.1 | JP1.27 72.55,3.97 72.55,7.62 JP2.27
  Bottom 0.152: JP2.27 72.23,8.73 72.23,10.48 71.28,11.43 v71.28,14.45 71.28,18.73 70.64,19.37 v70.64,36.83
B0_A12  (via drill 0.35)
  Top 0.152: IC8.4 6.19,41.27 6.83,40.64 26.19,40.64 26.83,41.27 IC7.4 27.78,41.27 28.1,40.96 39.53,40.96 39.85,40.64 46.51,40.64 47.15,41.27 IC6.4 48.1,41.27 48.42,40.96 59.85,40.96 60.17,40.64 66.83,40.64 67.47,41.27 IC2.4 71.44,41.27 v72.07,40.64 | v73.82,14.45 R13.1 | JP1.29 75.09,3.97 75.09,7.62 JP2.29 | R13.1 75.88,15.4 v76.04,15.4 | R13.1
  Bottom 0.152: v73.82,14.45 73.82,11.43 74.77,10.48 74.77,8.73 JP2.29 | v76.04,15.4 76.04,24.45 72.07,28.42 v72.07,40.64
B0_A13  (via drill 0.35)
  Top 0.152: v76.36,14.45 R14.1 | JP1.31 77.63,3.97 77.63,7.62 JP2.31 | IC8.28 19.37,40.01 19.68,40.32 26.35,40.32 26.67,40.64 39.37,40.64 40.01,40.01 IC7.28 46.35,40.01 46.99,40.64 49.05,40.64 49.37,40.32 60.8,40.32 61.12,40.01 IC6.28 66.67,40.01 67.31,40.64 69.37,40.64 70.01,40.01 v71.28,40.01 IC2.28
  Bottom 0.152: JP2.31 77.31,8.73 77.31,10.48 76.36,11.43 v76.36,14.45 76.04,14.45 71.28,19.21 v71.28,40.01
B0_A14  (via drill 0.35)
  Top 0.152: IC8.3 6.19,42.55 6.83,41.91 26.19,41.91 26.83,42.55 IC7.3 27.78,42.55 28.1,42.23 39.53,42.23 39.85,41.91 41.91,41.91 42.23,42.23 48.42,42.23 | v78.9,14.45 R15.1 | JP1.33 80.17,3.97 80.17,7.62 JP2.33 | 48.42,42.23 48.1,42.55 IC6.3 48.42,42.23 | 48.42,42.23 59.85,42.23 60.17,41.91 62.23,41.91 62.87,42.55 IC2.3 72.71,42.55 v73.34,41.91
  Bottom 0.152: v78.9,14.45 78.9,11.43 79.85,10.48 79.85,8.73 JP2.33 | JP1.33 79.85,2.54 81.28,3.97 81.6,3.97 82.71,5.08 82.71,18.73 73.34,28.1 v73.34,41.91
B0_A15  (via drill 0.35)
  Top 0.152: IC8.31 19.37,43.81 19.68,44.13 26.35,44.13 26.67,44.45 39.37,44.45 40.01,43.81 IC7.31 40.96,43.81 41.27,44.13 46.67,44.13 46.99,44.45 59.69,44.45 60.33,43.81 IC6.31 61.28,43.81 61.59,44.13 66.99,44.13 67.31,44.45 v72.71,44.45 80.8,44.45 81.44,43.81 IC2.31 | 82.55,7.62 R17.1 | JP2.35 82.55,7.62 | JP1.35 82.71,3.97 82.71,7.62 82.55,7.62
  Bottom 0.152: JP2.35 81.28,8.73 82.39,9.84 82.39,18.57 72.71,28.26 v72.71,44.45
B0_A16  (via drill 0.35)
  Top 0.152: IC8.2 6.19,43.81 6.83,43.18 26.19,43.18 26.83,43.81 IC7.2 27.78,43.81 28.1,43.5 39.53,43.5 39.85,43.18 v44.45,43.18 45.09,43.81 IC6.2 59.53,43.81 60.17,43.18 66.83,43.18 67.47,43.81 IC2.2 | JP2.6 44.29,11.27 46.51,11.27 46.51,12.38 46.35,12.54 43.81,12.54 R16.1
  Bottom 0.152: JP1.6 43.18,6.19 42.07,7.3 42.07,9.05 JP2.6 43.18,11.11 41.91,12.38 41.91,40.64 v44.45,43.18
B0_A17  (via drill 0.35)
  Top 0.152: IC8.1 6.19,45.09 6.83,44.45 26.19,44.45 26.83,45.09 IC7.1 27.78,45.09 28.1,44.77 39.53,44.77 39.85,44.45 46.04,44.45 v46.35,44.77 46.67,45.09 IC6.1 48.1,45.09 48.42,44.77 59.85,44.77 60.17,44.45 66.83,44.45 67.47,45.09 IC2.1 | 44.61,9.05 42.07,9.05 42.07,10.48 42.86,11.27 43.81,11.27 44.13,11.59 45.56,11.59 45.72,11.75 R18.1 | JP2.8 44.61,9.05 | JP1.8 45.72,6.51 46.04,6.51 46.83,7.3 46.83,9.05 44.61,9.05
  Bottom 0.152: JP2.8 45.72,11.11 46.51,11.91 46.51,44.61 v46.35,44.77
B0_A18  (via drill 0.35)
  Top 0.152: IC8.30 19.37,42.55 19.68,42.86 26.35,42.86 26.67,43.18 39.37,43.18 40.01,42.55 IC7.30 46.35,42.55 46.99,43.18 56.99,43.18 v57.31,42.86 57.63,42.55 IC6.30 61.28,42.55 61.59,42.86 66.99,42.86 67.31,43.18 80.8,43.18 81.44,42.55 IC2.30 | JP2.10 R19.1
  Bottom 0.152: 48.26,6.19 JP1.10 | 48.26,6.19 47.15,7.3 47.15,9.05 JP2.10 | 48.26,6.19 49.69,7.62 49.69,35.24 v57.31,42.86
B0_A19
  Top 0.152: R20.1 JP2.12 49.37,8.73 49.37,5.08 49.69,5.08 | 49.69,5.08 49.69,2.54 48.58,1.43 26.83,1.43 26.83,16.83 27.46,17.46 28.1,17.46 IC9.1 | JP1.12 49.69,5.08
B0_A20
  Top 0.152: R21.1 JP2.14 53.34,8.73 53.02,8.73 52.23,7.94 52.23,5.08 | 52.23,5.08 52.23,2.54 50.8,1.11 26.51,1.11 26.51,17.14 27.46,18.1 29.21,18.1 29.21,17.14 29.05,16.99 28.26,16.99 IC9.2 | JP1.14 52.23,5.08
B0_A21
  Top 0.152: R22.1 JP2.16 54.77,10.16 54.77,7.3 55.56,6.51 55.88,6.51 JP1.16
B0_A22
  Top 0.152: JP2.18 R23.1
  Bottom 0.152: JP1.18 58.42,6.19 57.31,7.3 57.31,9.05 JP2.18
B0_A23
  Top 0.152: JP2.20 R24.1
  Bottom 0.152: JP1.20 60.96,6.19 59.85,7.3 59.85,9.05 JP2.20
B0_A24
  Top 0.152: JP2.22 R26.1
  Bottom 0.152: JP1.22 63.5,6.19 62.39,7.3 62.39,9.05 JP2.22
B0_A25
  Top 0.152: JP2.24 R25.1
  Bottom 0.152: JP1.24 66.04,6.19 64.93,7.3 64.93,9.05 JP2.24
B0_A26
  Top 0.152: JP2.26 R27.1
  Bottom 0.152: JP1.26 68.58,6.19 67.47,7.3 67.47,9.05 JP2.26
B0_A27
  Top 0.152: JP2.28 R28.1
  Bottom 0.152: JP1.28 71.12,6.19 70.01,7.3 70.01,9.05 JP2.28
B0_A28
  Top 0.152: JP2.30 R29.1
  Bottom 0.152: JP1.30 73.66,6.19 72.55,7.3 72.55,9.05 JP2.30
B0_A29
  Top 0.152: JP2.32 R30.1
  Bottom 0.152: JP1.32 76.2,6.19 75.09,7.3 75.09,9.05 JP2.32
B0_A30
  Top 0.152: JP2.34 R31.1
  Bottom 0.152: JP1.34 78.74,6.19 77.63,7.3 77.63,9.05 JP2.34
B0_A31
  Top 0.152: JP2.36 R32.1
  Bottom 0.152: JP1.36 81.28,6.19 80.17,7.3 80.17,9.05 JP2.36
B0_D0
  Top 0.152: IC8.13 6.19,29.84 6.83,29.21 26.19,29.21 26.83,29.84 IC7.13 28.57,29.84 29.21,29.21 41.91,29.21 42.23,29.53 47.62,29.53 47.94,29.84 IC6.13 48.9,29.84 49.53,29.21 62.23,29.21 62.55,29.53 67.94,29.53 68.26,29.84 IC2.13 69.22,29.84 69.85,29.21 82.55,29.21 82.71,29.37 91.6,29.37 JP6.5
  Bottom 0.152: JP6.5 93.82,30.48 94.93,29.37 96.68,29.37 JP4.5
B0_D1
  Top 0.152: JP4.7 96.68,34.13 93.82,34.13 JP6.7 94.14,31.59 94.14,29.05 86.04,29.05 84.93,27.94 69.85,27.94 69.22,28.57 IC2.14 68.26,28.57 67.94,28.26 62.55,28.26 62.23,27.94 49.53,27.94 48.9,28.57 IC6.14 47.94,28.57 47.62,28.26 42.23,28.26 41.91,27.94 29.21,27.94 28.57,28.57 IC7.14 26.83,28.57 26.19,27.94 6.83,27.94 6.19,28.57 IC8.14
B0_D2  (via drill 0.35)
  Top 0.152: IC8.15 6.19,27.3 6.83,26.67 26.19,26.67 26.83,27.3 IC7.15 27.78,27.3 28.1,26.99 39.53,26.99 39.85,26.67 46.51,26.67 47.15,27.3 IC6.15 48.1,27.3 48.42,26.99 59.85,26.99 60.17,26.67 66.83,26.67 67.47,27.3 IC2.15 69.22,27.3 69.85,26.67 84.77,26.67 v85.41,27.3 | JP6.9 93.82,36.67 96.68,36.67 JP4.9
  Bottom 0.152: JP4.9 97.79,34.45 96.36,33.02 96.36,32.7 95.57,31.91 90.01,31.91 v85.41,27.3
B0_D3  (via drill 0.35)
  Top 0.152: JP6.11 93.82,39.21 96.68,39.21 JP4.11 | IC8.17 19.37,26.04 19.68,26.35 26.35,26.35 26.67,26.67 39.37,26.67 40.01,26.04 IC7.17 46.35,26.04 46.99,26.67 49.05,26.67 49.37,26.35 60.8,26.35 61.12,26.04 IC6.17 66.67,26.04 67.31,26.67 69.37,26.67 69.69,26.35 81.12,26.35 81.44,26.04 IC2.17 v84.14,26.04
  Bottom 0.152: JP6.11 92.08,38.1 90.65,36.67 89.85,36.67 83.82,30.64 83.82,26.35 v84.14,26.04
B0_D4  (via drill 0.35)
  Top 0.152: JP6.13 93.82,41.75 96.68,41.75 JP4.13 | IC8.18 19.37,27.3 19.68,27.62 26.35,27.62 26.67,27.94 28.73,27.94 29.37,27.3 IC7.18 41.75,27.3 42.39,27.94 49.05,27.94 49.37,27.62 60.8,27.62 61.12,27.3 IC6.18 62.07,27.3 62.71,27.94 69.37,27.94 69.69,27.62 81.12,27.62 81.44,27.3 IC2.18 v84.45,27.3
  Bottom 0.152: JP6.13 92.71,39.53 93.82,38.42 93.82,37.78 92.71,36.67 92.39,36.67 91.28,35.56 91.28,35.24 90.49,34.45 89.53,34.45 84.14,29.05 84.14,27.62 v84.45,27.3
B0_D5  (via drill 0.35)
  Top 0.152: JP6.15 93.82,44.29 96.68,44.29 JP4.15 | IC8.19 19.37,28.57 19.68,28.89 26.35,28.89 26.67,29.21 28.73,29.21 29.37,28.57 IC7.19 41.75,28.57 42.39,29.21 49.05,29.21 49.37,28.89 60.8,28.89 61.12,28.57 IC6.19 62.07,28.57 62.71,29.21 69.37,29.21 69.69,28.89 81.12,28.89 81.44,28.57 IC2.19 84.61,28.57 v84.77,28.73
  Bottom 0.152: JP6.15 92.71,42.07 94.14,40.64 94.14,35.56 93.03,34.45 90.96,34.45 90.65,34.13 89.85,34.13 84.77,29.05 v84.77,28.73
B0_D6  (via drill 0.35)
  Top 0.152: IC8.20 19.37,29.84 19.68,30.16 26.35,30.16 26.67,30.48 39.37,30.48 40.01,29.84 IC7.20 40.96,29.84 41.27,30.16 46.67,30.16 46.99,30.48 59.69,30.48 60.33,29.84 IC6.20 61.28,29.84 61.59,30.16 66.99,30.16 67.31,30.48 80.8,30.48 81.44,29.84 IC2.20 81.92,29.84 v84.45,32.38 | JP6.17 93.82,46.83 96.68,46.83 JP4.17
  Bottom 0.152: JP6.17 92.71,44.61 91.28,43.18 91.28,37.78 90.49,36.99 89.06,36.99 v84.45,32.38
B0_D7  (via drill 0.35)
  Top 0.152: IC8.21 19.37,31.11 19.68,31.43 26.35,31.43 26.67,31.75 38.73,31.75 39.37,31.11 IC7.21 40.96,31.11 41.27,31.43 46.67,31.43 46.99,31.75 59.69,31.75 60.33,31.11 IC6.21 61.28,31.11 61.59,31.43 66.99,31.43 67.31,31.75 80.01,31.75 | JP6.19 93.82,49.37 96.68,49.37 JP4.19 | 80.01,31.75 80.8,31.75 81.44,31.11 IC2.21 | 80.01,31.75 v80.01,31.59
  Bottom 0.152: JP6.19 91.6,48.26 90.17,49.69 87.15,49.69 83.5,53.34 82.87,53.34 82.39,52.86 82.39,46.04 85.41,43.02 85.41,36.99 v80.01,31.59
B1_A0  (via drill 0.35)
  Top 0.152: IC5.12 6.19,56.52 6.83,55.88 26.19,55.88 26.83,56.52 IC1.12 27.78,56.52 28.1,56.2 39.53,56.2 39.85,55.88 46.51,55.88 47.15,56.52 IC3.12 48.1,56.52 48.42,56.2 59.85,56.2 60.17,55.88 66.83,55.88 67.47,56.52 IC4.12 v70.48,56.52 | 82.39,91.44 82.39,85.41 81.92,84.93 80.17,84.93 80.01,84.77 R33.1 | JP5.5 82.39,91.44 | JP3.5 81.28,95.09 81.6,95.09 82.39,94.3 82.39,91.44
  Bottom 0.152: JP5.5 81.28,90.33 82.39,89.22 82.39,80.64 70.48,68.74 v70.48,56.52
B1_A1  (via drill 0.35)
  Top 0.152: IC5.11 6.19,57.78 6.83,57.15 26.19,57.15 26.83,57.78 IC1.11 27.78,57.78 28.1,57.47 39.53,57.47 39.85,57.15 46.51,57.15 47.15,57.78 IC3.11 48.1,57.78 48.42,57.47 59.85,57.47 60.17,57.15 66.83,57.15 67.47,57.78 IC4.11 70.8,57.78 v72.07,59.05 | 80.17,97.63 79.85,97.63 JP3.7 | 80.17,97.63 82.71,97.63 82.71,85.25 81.44,83.98 78.11,83.98 R34.1 | JP5.7 80.17,92.87 80.17,97.63
  Bottom 0.152: JP5.7 79.85,91.44 80.96,92.55 81.6,92.55 82.71,91.44 82.71,80.49 72.07,69.85 v72.07,59.05
B1_A2  (via drill 0.35)
  Top 0.152: R35.1 74.93,91.12 75.88,91.12 JP5.9 77.63,91.44 77.63,95.09 JP3.9 | 26.99,58.42 6.83,58.42 6.19,59.05 IC5.10 | 26.99,58.42 27.62,59.05 IC1.10 | 47.31,58.42 47.94,59.05 IC3.10 | 26.99,58.42 47.31,58.42 | 47.31,58.42 v66.83,58.42 67.63,58.42 68.26,59.05 IC4.10
  Bottom 0.152: JP5.9 76.2,90.33 75.09,89.22 75.09,76.99 66.83,68.74 v66.83,58.42
B1_A3  (via drill 0.35)
  Top 0.152: IC5.9 6.19,60.33 6.83,59.69 26.19,59.69 26.83,60.33 IC1.9 27.78,60.33 28.1,60.01 39.53,60.01 39.85,59.69 46.51,59.69 47.15,60.33 IC3.9 48.1,60.33 48.42,60.01 59.85,60.01 60.17,59.69 66.2,59.69 | v71.28,84.61 R36.1 | JP3.11 75.09,95.09 75.09,91.44 JP5.11 | 66.2,59.69 66.83,59.69 67.47,60.33 IC4.9 | 66.2,59.69 v66.2,60.01
  Bottom 0.152: JP5.11 74.77,90.33 74.77,88.58 71.28,85.09 v71.28,84.61 71.28,74.14 66.2,69.06 v66.2,60.01
B1_A4  (via drill 0.35)
  Top 0.152: IC5.8 6.19,61.59 6.51,61.28 17.94,61.28 18.26,60.96 26.19,60.96 26.83,61.59 IC1.8 27.78,61.59 28.1,61.28 39.53,61.28 39.85,60.96 46.51,60.96 47.15,61.59 IC3.8 48.1,61.59 48.42,61.28 59.85,61.28 60.17,60.96 64.77,60.96 | v68.74,84.61 R37.1 | JP3.13 72.55,95.09 72.55,91.44 JP5.13 | 64.77,60.96 66.83,60.96 67.47,61.59 IC4.8 | 64.77,60.96 v64.77,61.28
  Bottom 0.152: JP5.13 70.01,90.33 70.01,88.9 68.74,87.63 v68.74,84.61 66.52,82.39 66.52,69.85 64.77,68.1 v64.77,61.28
B1_A5  (via drill 0.35)
  Top 0.152: IC5.7 6.19,62.87 6.83,62.23 26.19,62.23 26.83,62.87 IC1.7 27.78,62.87 28.1,62.55 39.53,62.55 39.85,62.23 45.56,62.23 46.2,62.87 IC3.7 48.1,62.87 48.42,62.55 58.58,62.55 58.9,62.23 63.5,62.23 | v66.2,84.61 R38.1 | JP3.15 70.01,95.09 70.01,91.44 JP5.15 | 63.5,62.23 66.83,62.23 67.47,62.87 IC4.7 | 63.5,62.23 v63.5,62.55
  Bottom 0.152: JP5.15 67.47,90.33 67.47,88.9 66.2,87.63 v66.2,84.61 66.2,70.96 63.18,67.94 63.18,62.87 v63.5,62.55
B1_A6  (via drill 0.35)
  Top 0.152: IC5.6 6.19,64.14 6.83,63.5 26.19,63.5 26.83,64.14 IC1.6 27.78,64.14 28.1,63.82 39.53,63.82 39.85,63.5 46.51,63.5 47.15,64.14 IC3.6 48.1,64.14 48.42,63.82 v59.69,63.82 59.85,63.82 60.17,63.5 62.71,63.5 63.34,64.14 IC4.6 | v63.66,84.61 R39.1 | JP3.17 67.47,95.09 67.47,91.44 JP5.17
  Bottom 0.152: JP5.17 64.93,90.33 64.93,88.9 63.66,87.63 v63.66,84.61 63.66,81.12 61.44,78.9 61.44,65.56 v59.69,63.82
B1_A7  (via drill 0.35)
  Top 0.152: IC5.5 6.19,65.41 6.83,64.77 26.19,64.77 26.83,65.41 IC1.5 27.78,65.41 28.1,65.09 39.53,65.09 39.85,64.77 46.51,64.77 47.15,65.41 IC3.5 48.1,65.41 48.42,65.09 v59.69,65.09 59.85,65.09 60.17,64.77 66.83,64.77 67.47,65.41 IC4.5 | v61.12,84.61 R40.1 | JP3.19 64.93,95.09 64.93,91.44 JP5.19
  Bottom 0.152: JP5.19 62.39,90.33 62.39,88.9 61.12,87.63 v61.12,84.61 61.12,66.52 v59.69,65.09
B1_A8  (via drill 0.35)
  Top 0.152: IC5.27 19.37,64.14 19.68,64.45 26.35,64.45 26.67,64.77 39.37,64.77 40.01,64.14 IC1.27 40.96,64.14 41.27,64.45 46.67,64.45 46.99,64.77 58.26,64.77 v58.58,64.45 61.59,64.45 | v58.58,84.61 R41.1 | JP3.21 62.39,95.09 62.39,91.44 JP5.21 | 61.59,64.45 61.28,64.14 IC3.27 61.59,64.45 | 61.59,64.45 66.99,64.45 67.31,64.77 80.8,64.77 81.44,64.14 IC4.27
  Bottom 0.152: JP5.21 59.85,90.33 59.85,88.9 58.58,87.63 v58.58,84.61 v58.58,64.45
B1_A9  (via drill 0.35)
  Top 0.152: IC5.26 19.37,62.87 19.68,63.18 26.35,63.18 26.67,63.5 39.37,63.5 40.01,62.87 IC1.26 40.96,62.87 41.27,63.18 46.67,63.18 46.99,63.5 58.58,63.5 v59.21,62.87 IC3.26 61.28,62.87 61.59,63.18 62.87,63.18 63.18,63.5 80.8,63.5 81.44,62.87 IC4.26 | v56.04,84.61 R42.1 | JP3.23 59.85,95.09 59.85,91.44 JP5.23
  Bottom 0.152: JP5.23 57.31,90.33 57.31,88.9 56.04,87.63 v56.04,84.61 56.04,66.04 v59.21,62.87
B1_A10  (via drill 0.35)
  Top 0.152: IC5.23 19.37,59.05 19.68,59.37 26.35,59.37 26.67,59.69 39.37,59.69 40.01,59.05 IC1.23 40.96,59.05 41.27,59.37 46.67,59.37 46.99,59.69 59.05,59.69 v59.69,59.05 IC3.23 61.28,59.05 61.59,59.37 66.99,59.37 67.31,59.69 80.8,59.69 81.44,59.05 IC4.23 | v53.5,84.61 R43.1 | JP3.25 57.31,95.09 57.31,91.44 JP5.25
  Bottom 0.152: JP5.25 54.77,90.33 54.77,88.9 53.5,87.63 v53.5,84.61 53.5,65.25 v59.69,59.05
B1_A11  (via drill 0.35)
  Top 0.152: IC4.25 81.44,61.59 80.8,62.23 67.31,62.23 66.99,61.91 61.59,61.91 61.28,61.59 IC3.25 61.12,61.59 60.8,61.91 49.37,61.91 49.05,62.23 46.04,62.23 v45.4,61.59 IC1.25 40.01,61.59 39.37,62.23 26.67,62.23 26.35,61.91 19.68,61.91 19.37,61.59 IC5.25 | v50.96,84.61 R44.1 | JP3.27 54.77,95.09 54.77,91.44 JP5.27
  Bottom 0.152: JP5.27 52.23,90.33 52.23,88.9 50.96,87.63 v50.96,84.61 50.96,67.15 v45.4,61.59
B1_A12  (via drill 0.35)
  Top 0.152: IC5.4 6.19,66.67 6.83,66.04 26.19,66.04 26.83,66.67 IC1.4 27.78,66.67 28.1,66.36 39.53,66.36 39.85,66.04 44.93,66.04 45.24,66.36 48.42,66.36 | v48.42,84.61 R45.1 | JP3.29 52.23,95.09 52.23,91.44 JP5.29 | 48.42,66.36 48.1,66.67 IC3.4 48.42,66.36 | 49.53,66.36 59.85,66.36 60.17,66.04 66.83,66.04 67.47,66.67 IC4.4 | 49.53,66.36 48.42,66.36 | 49.53,66.36 v49.53,66.67
  Bottom 0.152: JP5.29 49.69,90.33 49.69,88.9 48.42,87.63 v48.42,84.61 48.42,84.3 49.53,83.19 v49.53,66.67
B1_A13  (via drill 0.35)
  Top 0.152: IC4.28 81.44,65.41 80.8,66.04 67.31,66.04 66.99,65.72 61.59,65.72 61.28,65.41 IC3.28 61.12,65.41 60.8,65.72 59.69,65.72 59.37,66.04 45.4,66.04 v44.77,65.41 IC1.28 39.37,65.41 38.73,66.04 26.67,66.04 26.35,65.72 19.68,65.72 19.37,65.41 IC5.28 | v48.1,83.66 47.94,83.66 R46.1 | JP3.31 49.69,95.09 49.69,91.44 JP5.31
  Bottom 0.152: JP5.31 47.15,90.33 47.15,84.93 48.1,83.98 v48.1,83.66 48.1,68.74 v44.77,65.41
B1_A14  (via drill 0.35)
  Top 0.152: IC5.3 6.19,67.94 6.83,67.31 26.19,67.31 26.83,67.94 IC1.3 27.78,67.94 28.1,67.63 39.53,67.63 39.85,67.31 45.72,67.31 v46.35,67.94 IC3.3 48.1,67.94 48.42,67.63 59.85,67.63 60.17,67.31 66.83,67.31 67.47,67.94 IC4.3 | 44.61,91.44 44.61,88.42 45.72,87.31 R47.1 | JP5.33 44.61,91.44 | JP3.33 44.29,95.09 44.29,91.44 44.61,91.44
  Bottom 0.152: JP5.33 45.72,90.33 46.83,89.22 46.83,68.42 v46.35,67.94
B1_A15  (via drill 0.35)
  Top 0.152: IC4.31 81.44,69.22 80.8,69.85 67.31,69.85 66.99,69.53 61.59,69.53 61.28,69.22 IC3.31 61.12,69.22 60.8,69.53 49.37,69.53 49.05,69.85 46.99,69.85 46.35,69.22 IC1.31 40.01,69.22 39.37,69.85 v38.89,69.85 26.67,69.85 26.35,69.53 19.68,69.53 19.37,69.22 IC5.31 | 41.91,91.44 R49.1 | JP5.35 41.91,91.44 | JP3.35 41.75,95.09 41.75,91.44 41.91,91.44
  Bottom 0.152: JP5.35 43.18,90.33 41.75,88.9 41.75,72.71 v38.89,69.85
B1_A16  (via drill 0.35)
  Top 0.152: IC5.2 6.19,69.22 6.83,68.58 26.19,68.58 26.83,69.22 IC1.2 27.78,69.22 28.1,68.9 39.53,68.9 39.85,68.58 41.91,68.58 42.23,68.9 48.42,68.9 | R48.1 JP5.6 80.17,88.9 80.17,91.76 80.96,92.55 81.28,92.55 JP3.6 | 48.42,68.9 48.1,69.22 IC3.2 48.42,68.9 | 48.42,68.9 59.85,68.9 60.17,68.58 62.23,68.58 62.87,69.22 IC4.2 v70.01,69.22
  Bottom 0.152: JP5.6 81.28,80.49 v70.01,69.22
B1_A17  (via drill 0.35)
  Top 0.152: IC5.1 6.19,70.48 6.83,69.85 26.19,69.85 26.83,70.48 IC1.1 39.21,70.48 39.85,69.85 46.51,69.85 47.15,70.48 IC3.1 48.1,70.48 48.42,70.17 59.85,70.17 60.17,69.85 66.83,69.85 67.47,70.48 IC4.1 v70.01,70.48 | JP5.8 R50.1
  Bottom 0.152: JP3.8 78.74,92.87 77.63,91.76 77.63,90.01 JP5.8 78.74,79.22 v70.01,70.48
B1_A18  (via drill 0.35)
  Top 0.152: JP5.10 R51.1 | IC5.30 19.37,67.94 19.68,68.26 26.35,68.26 26.67,68.58 38.89,68.58 39.53,67.94 IC1.30 41.75,67.94 42.39,68.58 49.05,68.58 49.37,68.26 60.8,68.26 61.12,67.94 IC3.30 62.07,67.94 62.71,68.58 69.37,68.58 v69.85,68.1 70.01,67.94 IC4.30
  Bottom 0.152: JP3.10 76.2,92.87 77.31,91.76 77.31,90.01 JP5.10 76.2,77.63 69.37,70.8 69.37,68.58 v69.85,68.1
B1_A19  (via drill 0.35)
  Top 0.152: JP5.12 R52.1 | v67.15,82.07 33.81,82.07 IC10.1
  Bottom 0.152: 72.55,87.47 73.66,88.58 JP5.12 | 72.55,87.47 v67.15,82.07 | JP3.12 73.66,92.87 72.55,91.76 72.55,87.47
B1_A20  (via drill 0.35)
  Top 0.152: JP5.14 R53.1 | v35.24,83.5 34.77,83.03 33.97,83.03 33.81,82.87 IC10.2
  Bottom 0.152: v35.24,83.5 35.24,92.55 37.78,95.09 70.01,95.09 JP3.14 72.23,92.87 72.23,91.12 71.12,90.01 JP5.14
B1_A21
  Top 0.152: JP5.16 R54.1
  Bottom 0.152: JP3.16 68.58,92.87 69.69,91.76 69.69,90.01 JP5.16
B1_A22
  Top 0.152: JP5.18 R55.1
  Bottom 0.152: JP3.18 66.04,92.87 67.15,91.76 67.15,90.01 JP5.18
B1_A23
  Top 0.152: JP5.20 R56.1
  Bottom 0.152: JP3.20 63.5,92.87 64.61,91.76 64.61,90.01 JP5.20
B1_A24
  Top 0.152: JP5.22 R58.1
  Bottom 0.152: JP3.22 60.96,92.87 62.07,91.76 62.07,90.01 JP5.22
B1_A25
  Top 0.152: JP5.24 R57.1
  Bottom 0.152: JP3.24 58.42,92.87 59.53,91.76 59.53,90.01 JP5.24
B1_A26
  Top 0.152: JP5.26 R59.1
  Bottom 0.152: JP3.26 55.88,92.87 56.99,91.76 56.99,90.01 JP5.26
B1_A27
  Top 0.152: JP5.28 R60.1
  Bottom 0.152: JP3.28 53.34,92.87 54.45,91.76 54.45,90.01 JP5.28
B1_A28
  Top 0.152: JP5.30 R61.1
  Bottom 0.152: JP3.30 50.8,92.87 51.91,91.76 51.91,90.01 JP5.30
B1_A29
  Top 0.152: R62.1 JP5.32 46.83,88.9 46.83,92.55 JP3.32
B1_A30  (via drill 0.35)
  Top 0.152: v45.56,84.61 R63.1
  Bottom 0.152: v45.56,84.61 45.56,88.74 JP5.34 44.61,90.01 44.61,91.76 45.72,92.87 JP3.34
B1_A31
  Top 0.152: JP5.36 R64.1
  Bottom 0.152: JP3.36 43.18,92.87 44.29,91.76 44.29,90.01 JP5.36
B1_D0
  Top 0.152: IC5.13 6.19,55.24 6.83,54.61 26.19,54.61 26.83,55.24 IC1.13 28.57,55.24 29.21,54.61 41.91,54.61 42.23,54.93 47.62,54.93 47.94,55.24 IC3.13 48.9,55.24 49.53,54.61 62.23,54.61 62.55,54.93 67.94,54.93 68.26,55.24 IC4.13 69.22,55.24 69.85,54.61 83.82,54.61 83.82,37.62 87,34.45 91.6,34.45 91.6,31.91 JP6.6
  Bottom 0.152: JP6.6 91.28,30.48 92.39,31.59 94.14,31.59 JP4.6
B1_D1  (via drill 0.35)
  Top 0.152: IC5.14 6.19,53.98 6.83,53.34 26.19,53.34 26.83,53.98 IC1.14 27.78,53.98 28.1,53.66 39.53,53.66 39.85,53.34 46.51,53.34 47.15,53.98 IC3.14 48.1,53.98 48.42,53.66 59.85,53.66 60.17,53.34 66.67,53.34 | 66.67,53.34 66.83,53.34 67.47,53.98 IC4.14 | JP6.8 89.06,34.13 86.2,34.13 v83.19,37.15 | 66.67,53.34 v66.67,53.66
  Bottom 0.152: JP6.8 91.28,33.02 92.39,34.13 94.14,34.13 JP4.8 | v66.67,53.66 v83.19,37.15
B1_D2  (via drill 0.35)
  Top 0.152: JP4.10 94.14,34.45 92.39,34.45 92.08,34.77 90.96,34.77 JP6.10 87.79,37.94 v84.45,37.94 | IC5.15 6.19,52.7 6.83,52.07 26.19,52.07 26.83,52.7 IC1.15 28.57,52.7 29.21,52.07 41.91,52.07 42.23,52.39 47.62,52.39 47.94,52.7 IC3.15 48.9,52.7 49.53,52.07 62.23,52.07 62.55,52.39 67.94,52.39 68.26,52.7 IC4.15 69.69,52.7 v69.85,52.55
  Bottom 0.152: v69.85,52.55 v84.45,37.94
B1_D3  (via drill 0.35)
  Top 0.152: JP6.12 91.28,36.99 94.14,36.99 JP4.12 | IC5.17 19.37,51.44 19.68,51.75 26.35,51.75 26.67,52.07 28.73,52.07 29.37,51.44 IC1.17 41.75,51.44 42.39,52.07 49.05,52.07 49.37,51.75 60.8,51.75 61.12,51.44 IC3.17 62.07,51.44 62.71,52.07 69.37,52.07 69.53,51.91 80.96,51.91 81.44,51.44 IC4.17 81.6,51.44 82.23,50.8 83.03,50.8 v83.03,46.35
  Bottom 0.152: JP6.12 90.17,39.21 v83.03,46.35
B1_D4  (via drill 0.35)
  Top 0.152: IC5.18 19.37,52.7 19.68,53.02 26.35,53.02 26.67,53.34 39.37,53.34 40.01,52.7 IC1.18 40.96,52.7 41.27,53.02 46.67,53.02 46.99,53.34 59.69,53.34 60.33,52.7 IC3.18 61.28,52.7 61.59,53.02 66.99,53.02 67.31,53.34 80.8,53.34 81.44,52.7 IC4.18 81.92,52.7 v83.19,51.44 | JP6.14 91.28,39.53 94.14,39.53 JP4.14
  Bottom 0.152: JP6.14 90.17,41.75 83.19,48.74 v83.19,51.44
B1_D5  (via drill 0.35)
  Top 0.152: JP6.16 91.28,42.07 94.14,42.07 JP4.16 | IC5.19 19.37,53.98 19.68,54.29 26.35,54.29 26.67,54.61 28.73,54.61 29.37,53.98 IC1.19 41.75,53.98 42.39,54.61 49.05,54.61 49.37,54.29 60.8,54.29 61.12,53.98 IC3.19 62.07,53.98 62.71,54.61 69.37,54.61 69.69,54.29 81.12,54.29 81.44,53.98 IC4.19 81.92,53.98 v83.19,52.7
  Bottom 0.152: JP6.16 90.17,44.29 83.82,50.64 83.82,52.07 v83.19,52.7
B1_D6
  Top 0.152: IC5.20 19.37,55.24 19.68,55.56 26.35,55.56 26.67,55.88 39.37,55.88 40.01,55.24 IC1.20 40.96,55.24 41.27,55.56 46.67,55.56 46.99,55.88 59.69,55.88 60.33,55.24 IC3.20 61.28,55.24 61.59,55.56 66.99,55.56 67.31,55.88 80.8,55.88 81.44,55.24 IC4.20 83.66,55.24 84.14,54.77 84.14,51.75 JP6.18 91.28,44.61 94.14,44.61 JP4.18
B1_D7
  Top 0.152: IC5.21 19.37,56.52 19.68,56.83 26.35,56.83 26.67,57.15 39.37,57.15 40.01,56.52 IC1.21 40.96,56.52 41.27,56.83 46.67,56.83 46.99,57.15 59.69,57.15 60.33,56.52 IC3.21 61.28,56.52 61.59,56.83 66.99,56.83 67.31,57.15 80.8,57.15 81.44,56.52 IC4.21 84.45,56.52 84.45,53.98 JP6.20 91.28,47.15 94.14,47.15 JP4.20
CE0  (via drill 0.35)
  Top 0.152: IC8.22 v20.95,32.38 | IC9.15 34.05,16.83 32.7,16.83 v32.7,18.73
  Bottom 0.152: v20.95,32.38 20.95,18.73 v32.7,18.73
CE1  (via drill 0.35)
  Top 0.152: IC2.22 v83.5,32.38 | IC9.14 32.07,16.21 32.07,19.37 v83.5,19.37
  Bottom 0.152: v83.5,32.38 v83.5,19.37
CE2  (via drill 0.35)
  Top 0.152: IC6.22 v62.87,32.38 | IC9.13 31.43,15.56 31.43,20 v62.87,20
  Bottom 0.152: v62.87,32.38 v62.87,20
CE3  (via drill 0.35)
  Top 0.152: IC7.22 v42.55,32.38 | IC9.12 30.8,14.91 30.8,20.64 v42.55,20.64
  Bottom 0.152: v42.55,32.38 v42.55,20.64
CE4  (via drill 0.35)
  Top 0.152: IC5.22 v20.95,57.78 | IC10.15 29.21,82.83 v29.21,78.42
  Bottom 0.152: v20.95,57.78 20.95,78.42 26.04,78.42 v29.21,78.42
CE5  (via drill 0.35)
  Top 0.152: IC1.22 v42.55,57.78 | v42.55,78.74 29.84,78.74 29.84,83.5 27.86,83.5 IC10.14
  Bottom 0.152: v42.55,57.78 v42.55,78.74
CE6  (via drill 0.35)
  Top 0.152: IC3.22 v62.87,57.78 | v62.87,79.38 30.48,79.38 30.48,84.14 IC10.13
  Bottom 0.152: v62.87,57.78 v62.87,79.38
CE7  (via drill 0.35)
  Top 0.152: IC4.22 v83.19,57.78 | v83.19,80.01 63.57,80.01 63.57,80.08 31.11,80.08 31.11,84.78 IC10.12
  Bottom 0.152: v83.19,57.78 v83.19,80.01
GND  (via drill 0.35)
  Top 0.203: C8.1 17.75,73.3 | 18.7,74.24 v18.92,74.24
  Top 0.508: 17.75,73.3 18.7,74.24
  other vias: 26.04,86.36 79.38,48.26 59.05,48.26 38.73,48.26 17.14,48.26
  pour Top: 0,99.06 100.33,99.06 100.33,0 0,0
  pour Bottom: 0,99.69 100.33,99.69 100.33,0 0,0
OE  (via drill 0.35)
  Top 0.152: 64.29,35.24 66.99,35.24 67.31,35.56 80.8,35.56 81.44,34.92 IC2.24 | 64.29,35.24 61.59,35.24 61.28,34.92 IC6.24 | 64.29,60.64 66.99,60.64 67.31,60.96 80.8,60.96 81.44,60.33 IC4.24 | 64.29,60.64 61.59,60.64 61.28,60.33 IC3.24 61.12,60.33 60.8,60.64 49.37,60.64 49.05,60.96 46.99,60.96 46.35,60.33 IC1.24 40.01,60.33 39.37,60.96 26.67,60.96 26.35,60.64 19.68,60.64 19.37,60.33 IC5.24 18.41,60.33 17.78,60.96 4.76,60.96 4.76,35.88 5.08,35.56 7.14,35.56 7.46,35.24 18.89,35.24 19.21,34.92 IC8.24 19.37,34.92 19.68,35.24 26.35,35.24 26.67,35.56 39.37,35.56 40.01,34.92 IC7.24 | v64.29,34.92 64.29,35.24 | 64.29,60.64 v64.29,60.33
  Bottom 0.152: v64.29,60.33 v64.29,34.92
VCC  (via drill 0.35)
  Top 0.152: C10.2 35.08,17.49 | 35.08,17.49 34.05,17.49 IC9.16 | C1.2 27.86,82.21 IC10.16 | 86.36,73.5 82.87,73.5 81.54,72.94 | 36.67,87.63 37.78,88.74 JP5.40 | 36.67,87.63 34.61,85.57 33.81,85.57 IC10.6 | 25.88,82.39 25.24,83.03 25.24,87.63 36.67,87.63 | 25.88,82.39 26.04,82.23 C1.2 | 40.9,71.6 59.05,71.6 60.17,72.71 C6.2 | 25.88,82.39 16.35,72.87 16.35,71.6 19.05,71.6 38.85,71.6 39.61,72.36 39.61,72.6 C5.2 | 25.88,82.39 C1.2 | 61.22,71.6 79.38,71.6 80.49,72.71 80.66,73.01 C2.2 | JP4.1 97.62,25.4 | 86.52,10.48 JP2.40 | 90.49,25.08 JP6.2 | v31.59,14.13 28.26,14.13 IC9.6 | 35.08,17.49 35.08,15.08 v35.4,15.08 | 40.9,46.04 v35.4,46.04 19.31,46.04 | 40.9,46.2 59.69,46.2 60.17,46.67 C7.2 | 61.22,46.2 80.01,46.2 80.49,46.67 C3.2
  Top 0.203: 19.05,71.6 19.07,71.6 C8.2
  Top 0.813: C5.2 40.9,73.03 40.9,71.6 IC1.32 | C6.2 61.22,73.03 61.22,71.6 IC3.32 | C9.2 19.31,46.99 19.31,46.04 IC8.32 | C4.2 40.9,46.99 40.9,46.2 40.9,46.04 IC7.32 | C7.2 61.22,46.99 61.22,46.2 IC6.32 | C3.2 81.54,46.99 IC2.32 | JP2.2 JP2.1 JP1.2 JP1.1 | JP1.39 JP1.40 JP2.39 JP2.40 86.36,25.4 JP6.2 JP6.1 JP4.2 JP4.1 | JP4.39 JP4.40 JP6.39 JP6.40 86.36,73.66 JP5.2 JP5.1 JP3.2 JP3.1 | JP3.39 JP3.40 JP5.39 JP5.40 | IC5.32 19.31,72.79 C8.2 | IC4.32 81.54,72.94 80.66,72.94 80.66,73.01
  Bottom 0.152: JP2.1 33.02,12.7 | 33.02,12.7 v31.59,14.13 | 33.02,12.7 v35.4,15.08 v35.4,46.04 38.1,48.74 JP5.40
  Bottom 0.254: JP1.1 39.5,1.14 84.96,1.14 JP1.39 | JP4.1 99.06,26.67 99.06,72.39 JP4.39 | JP3.1 85.29,97.59 39.17,97.59 JP3.39
WE  (via drill 0.35)
  Top 0.152: IC8.29 19.37,41.27 19.68,41.59 26.35,41.59 26.67,41.91 39.37,41.91 40.01,41.27 IC7.29 41.75,41.27 42.39,41.91 49.05,41.91 49.37,41.59 60.8,41.59 61.12,41.27 IC6.29 62.07,41.27 62.71,41.91 v65.56,41.91 71.28,41.91 71.91,41.27 IC2.29 | 65.56,66.99 66.99,66.99 67.31,67.31 80.8,67.31 81.44,66.67 IC4.29 | 65.56,66.99 61.59,66.99 61.28,66.67 IC3.29 61.12,66.67 60.8,66.99 50.16,66.99 49.85,67.31 46.2,67.31 45.56,66.67 IC1.29 40.01,66.67 39.37,67.31 26.67,67.31 26.35,66.99 19.68,66.99 19.37,66.67 IC5.29 | 65.56,66.99 v65.56,66.67
  Bottom 0.152: v65.56,66.67 v65.56,41.91

### Text on the board
tDocu: rv32i ram module v1.0